# Altium project Gesturelink.PrjPcb (part 2 of 4)

## Sheet LPDDR4.SchDoc
size 420 x 297 mm; SheetNumber: 5; SheetTotal: 16
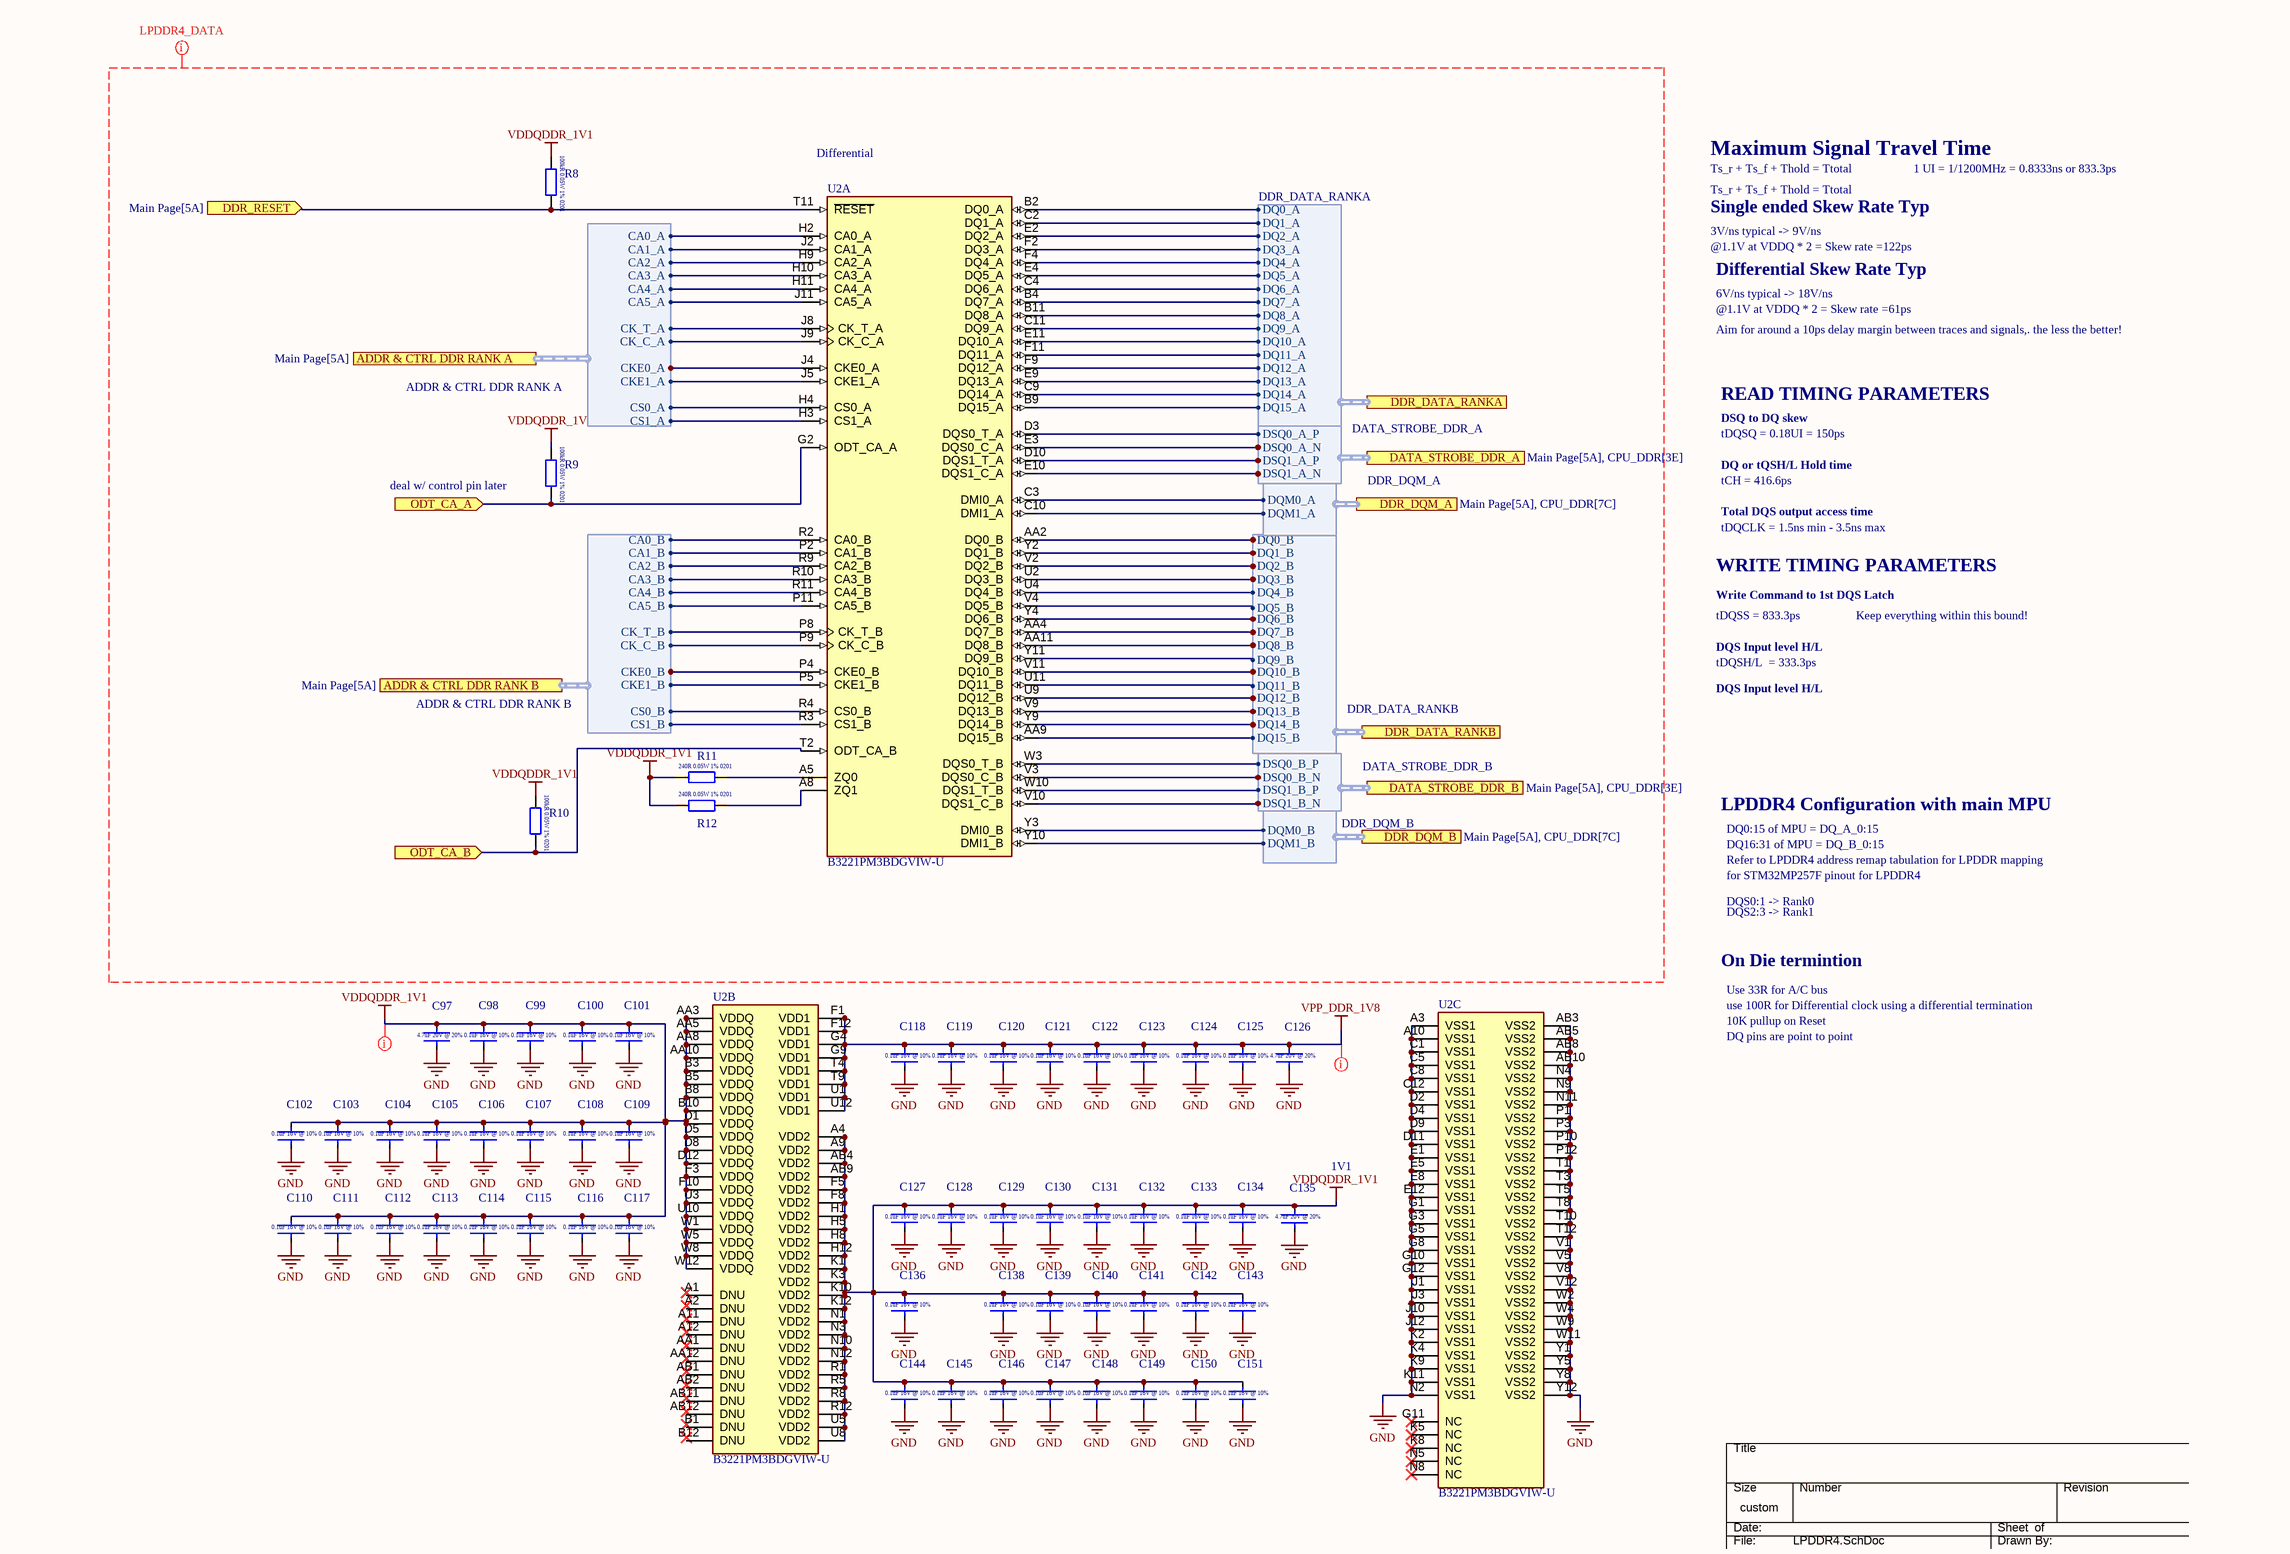
[diagram p5: LPDDR4.SchDoc]

### Parts
C97  4.7uF  [CAPC1005X06L]  (value not drawn)
C98  0.1uF  [CAPC0603X03L]  (value not drawn)
C99  0.1uF  [CAPC0603X03L]  (value not drawn)
C100  0.1uF  [CAPC0603X03L]  (value not drawn)
C101  0.1uF  [CAPC0603X03L]  (value not drawn)
C102  0.1uF  [CAPC0603X03L]  (value not drawn)
C103  0.1uF  [CAPC0603X03L]  (value not drawn)
C104  0.1uF  [CAPC0603X03L]  (value not drawn)
C105  0.1uF  [CAPC0603X03L]  (value not drawn)
C106  0.1uF  [CAPC0603X03L]  (value not drawn)
C107  0.1uF  [CAPC0603X03L]  (value not drawn)
C108  0.1uF  [CAPC0603X03L]  (value not drawn)
C109  0.1uF  [CAPC0603X03L]  (value not drawn)
C110  0.1uF  [CAPC0603X03L]  (value not drawn)
C111  0.1uF  [CAPC0603X03L]  (value not drawn)
C112  0.1uF  [CAPC0603X03L]  (value not drawn)
C113  0.1uF  [CAPC0603X03L]  (value not drawn)
C114  0.1uF  [CAPC0603X03L]  (value not drawn)
C115  0.1uF  [CAPC0603X03L]  (value not drawn)
C116  0.1uF  [CAPC0603X03L]  (value not drawn)
C117  0.1uF  [CAPC0603X03L]  (value not drawn)
C118  0.1uF  [CAPC0603X03L]  (value not drawn)
C119  0.1uF  [CAPC0603X03L]  (value not drawn)
C120  0.1uF  [CAPC0603X03L]  (value not drawn)
C121  0.1uF  [CAPC0603X03L]  (value not drawn)
C122  0.1uF  [CAPC0603X03L]  (value not drawn)
C123  0.1uF  [CAPC0603X03L]  (value not drawn)
C124  0.1uF  [CAPC0603X03L]  (value not drawn)
C125  0.1uF  [CAPC0603X03L]  (value not drawn)
C126  4.7uF  [CAPC1005X06L]  (value not drawn)
C127  0.1uF  [CAPC0603X03L]  (value not drawn)
C128  0.1uF  [CAPC0603X03L]  (value not drawn)
C129  0.1uF  [CAPC0603X03L]  (value not drawn)
C130  0.1uF  [CAPC0603X03L]  (value not drawn)
C131  0.1uF  [CAPC0603X03L]  (value not drawn)
C132  0.1uF  [CAPC0603X03L]  (value not drawn)
C133  0.1uF  [CAPC0603X03L]  (value not drawn)
C134  0.1uF  [CAPC0603X03L]  (value not drawn)
C135  4.7uF  [CAPC1005X06L]  (value not drawn)
C136  0.1uF  [CAPC0603X03L]  (value not drawn)
C138  0.1uF  [CAPC0603X03L]  (value not drawn)
C139  0.1uF  [CAPC0603X03L]  (value not drawn)
C140  0.1uF  [CAPC0603X03L]  (value not drawn)
C141  0.1uF  [CAPC0603X03L]  (value not drawn)
C142  0.1uF  [CAPC0603X03L]  (value not drawn)
C143  0.1uF  [CAPC0603X03L]  (value not drawn)
C144  0.1uF  [CAPC0603X03L]  (value not drawn)
C145  0.1uF  [CAPC0603X03L]  (value not drawn)
C146  0.1uF  [CAPC0603X03L]  (value not drawn)
C147  0.1uF  [CAPC0603X03L]  (value not drawn)
C148  0.1uF  [CAPC0603X03L]  (value not drawn)
C149  0.1uF  [CAPC0603X03L]  (value not drawn)
C150  0.1uF  [CAPC0603X03L]  (value not drawn)
C151  0.1uF  [CAPC0603X03L]  (value not drawn)
R8  ERJ-1GNF1003C  [RESC0603X03L]  (value not drawn)
R9  ERJ-1GNF1003C  [RESC0603X03L]  (value not drawn)
R10  ERJ-1GNF1003C  [RESC0603X03L]  (value not drawn)
R11  ERJ-1GNF2400C  [RESC0603X03L]  (value not drawn)
R12  ERJ-1GNF2400C  [RESC0603X03L]  (value not drawn)
U2  B3221PM3BDGVIW-U  [Q6422PM3BDGVK-U]  (parts A,B,C of 3)

### Ports
ADDR & CTRL DDR RANK A (harness ADDR & CTRL DDR RANK A, see Main Page[5A]), ADDR & CTRL DDR RANK B (harness ADDR & CTRL DDR RANK B, see Main Page[5A]), DATA_STROBE_DDR_A (harness DATA_STROBE_DDR_A, see Main Page[5A], CPU_DDR[3E]), DATA_STROBE_DDR_B (harness DATA_STROBE_DDR_B, see Main Page[5A], CPU_DDR[3E]), DDR_DATA_RANKA (harness DDR_DATA_RANKA, see Main Page[5A], CPU_DDR[3D]), DDR_DATA_RANKB (harness DDR_DATA_RANKB, see Main Page[5A], CPU_DDR[3E]), DDR_DQM_A (harness DDR_DQM_A, see Main Page[5A], CPU_DDR[7C]), DDR_DQM_B (harness DDR_DQM_B, see Main Page[5A], CPU_DDR[7C]), DDR_RESET (in, see Main Page[5A]), ODT_CA_A (in), ODT_CA_B (in)

### Harnesses
DDR_DATA_RANKB: DQ0_B, DQ10_B, DQ11_B, DQ12_B, DQ13_B, DQ14_B, DQ15_B, DQ1_B, DQ2_B, DQ3_B, DQ4_B, DQ5_B, DQ6_B, DQ7_B, DQ8_B, DQ9_B
DDR_DATA_RANKA: DQ0_A, DQ10_A, DQ11_A, DQ12_A, DQ13_A, DQ14_A, DQ15_A, DQ1_A, DQ2_A, DQ3_A, DQ4_A, DQ5_A, DQ6_A, DQ7_A, DQ8_A, DQ9_A
ADDR & CTRL DDR RANK A: CA0_A, CA1_A, CA2_A, CA3_A, CA4_A, CA5_A, CKE0_A, CKE1_A, CK_C_A, CK_T_A, CS0_A, CS1_A
ADDR & CTRL DDR RANK B: CA0_B, CA1_B, CA2_B, CA3_B, CA4_B, CA5_B, CKE0_B, CKE1_B, CK_C_B, CK_T_B, CS0_B, CS1_B
DATA_STROBE_DDR_A: DSQ0_A_N, DSQ0_A_P, DSQ1_A_N, DSQ1_A_P
DATA_STROBE_DDR_B: DSQ0_B_N, DSQ0_B_P, DSQ1_B_N, DSQ1_B_P
DDR_DQM_A: DQM0_A, DQM1_A
DDR_DQM_B: DQM0_B, DQM1_B

### Nets
GND: C97.1 C98.1 C99.1 C100.1 C101.1 C102.1 C103.1 C104.1 C105.1 C106.1 C107.1 C108.1 C109.1 C110.1 C111.1 C112.1 C113.1 C114.1 C115.1 C116.1 C117.1 C118.1 C119.1 C120.1 C121.1 C122.1 C123.1 C124.1 C125.1 C126.1 C127.1 C128.1 C129.1 C130.1 C131.1 C132.1 C133.1 C134.1 C135.1 C136.1 C138.1 C139.1 C140.1 C141.1 C142.1 C143.1 C144.1 C145.1 C146.1 C147.1 C148.1 C149.1 C150.1 C151.1 U2.A3(VSS1) U2.A10(VSS1) U2.AB3(VSS2) U2.AB5(VSS2) U2.AB8(VSS2) U2.AB10(VSS2) U2.C1(VSS1) U2.C5(VSS1) U2.C8(VSS1) U2.C12(VSS1) U2.D2(VSS1) U2.D4(VSS1) U2.D9(VSS1) U2.D11(VSS1) U2.E1(VSS1) U2.E5(VSS1) U2.E8(VSS1) U2.E12(VSS1) U2.G1(VSS1) U2.G3(VSS1) U2.G5(VSS1) U2.G8(VSS1) U2.G10(VSS1) U2.G12(VSS1) U2.J1(VSS1) U2.J3(VSS1) U2.J10(VSS1) U2.J12(VSS1) U2.K2(VSS1) U2.K4(VSS1) U2.K9(VSS1) U2.K11(VSS1) U2.N2(VSS1) U2.N4(VSS2) U2.N9(VSS2) U2.N11(VSS2) U2.P1(VSS2) U2.P3(VSS2) U2.P10(VSS2) U2.P12(VSS2) U2.T1(VSS2) U2.T3(VSS2) U2.T5(VSS2) U2.T8(VSS2) U2.T10(VSS2) U2.T12(VSS2) U2.V1(VSS2) U2.V5(VSS2) U2.V8(VSS2) U2.V12(VSS2) U2.W2(VSS2) U2.W4(VSS2) U2.W9(VSS2) U2.W11(VSS2) U2.Y1(VSS2) U2.Y5(VSS2) U2.Y8(VSS2) U2.Y12(VSS2)
VDDQDDR_1V1: C97.2 C98.2 C99.2 C100.2 C101.2 C102.2 C103.2 C104.2 C105.2 C106.2 C107.2 C108.2 C109.2 C110.2 C111.2 C112.2 C113.2 C114.2 C115.2 C116.2 C117.2 C127.2 C128.2 C129.2 C130.2 C131.2 C132.2 C133.2 C134.2 C135.2 C136.2 C138.2 C139.2 C140.2 C141.2 C142.2 C143.2 C144.2 C145.2 C146.2 C147.2 C148.2 C149.2 C150.2 C151.2 R8.1 R9.1 R10.1 R11.1 R12.1 U2.A4(VDD2) U2.A9(VDD2) U2.AA3(VDDQ) U2.AA5(VDDQ) U2.AA8(VDDQ) U2.AA10(VDDQ) U2.AB4(VDD2) U2.AB9(VDD2) U2.B3(VDDQ) U2.B5(VDDQ) U2.B8(VDDQ) U2.B10(VDDQ) U2.D1(VDDQ) U2.D5(VDDQ) U2.D8(VDDQ) U2.D12(VDDQ) U2.F3(VDDQ) U2.F5(VDD2) U2.F8(VDD2) U2.F10(VDDQ) U2.H1(VDD2) U2.H5(VDD2) U2.H8(VDD2) U2.H12(VDD2) U2.K1(VDD2) U2.K3(VDD2) U2.K10(VDD2) U2.K12(VDD2) U2.N1(VDD2) U2.N3(VDD2) U2.N10(VDD2) U2.N12(VDD2) U2.R1(VDD2) U2.R5(VDD2) U2.R8(VDD2) U2.R12(VDD2) U2.U3(VDDQ) U2.U5(VDD2) U2.U8(VDD2) U2.U10(VDDQ) U2.W1(VDDQ) U2.W5(VDDQ) U2.W8(VDDQ) U2.W12(VDDQ)
VPP_DDR_1V8: C118.2 C119.2 C120.2 C121.2 C122.2 C123.2 C124.2 C125.2 C126.2 U2.F1(VDD1) U2.F12(VDD1) U2.G4(VDD1) U2.G9(VDD1) U2.T4(VDD1) U2.T9(VDD1) U2.U1(VDD1) U2.U12(VDD1)
DDR_CA0_A: U2.H2(CA0_A) ; port ADDR & CTRL DDR RANK A.CA0_A
DDR_CA0_B: U2.R2(CA0_B) ; port ADDR & CTRL DDR RANK B.CA0_B
DDR_CA1_A: U2.J2(CA1_A) ; port ADDR & CTRL DDR RANK A.CA1_A
DDR_CA1_B: U2.P2(CA1_B) ; port ADDR & CTRL DDR RANK B.CA1_B
DDR_CA2_A: U2.H9(CA2_A) ; port ADDR & CTRL DDR RANK A.CA2_A
DDR_CA2_B: U2.R9(CA2_B) ; port ADDR & CTRL DDR RANK B.CA2_B
DDR_CA3_A: U2.H10(CA3_A) ; port ADDR & CTRL DDR RANK A.CA3_A
DDR_CA3_B: U2.R10(CA3_B) ; port ADDR & CTRL DDR RANK B.CA3_B
DDR_CA4_A: U2.H11(CA4_A) ; port ADDR & CTRL DDR RANK A.CA4_A
DDR_CA4_B: U2.R11(CA4_B) ; port ADDR & CTRL DDR RANK B.CA4_B
DDR_CA5_A: U2.J11(CA5_A) ; port ADDR & CTRL DDR RANK A.CA5_A
DDR_CA5_B: U2.P11(CA5_B) ; port ADDR & CTRL DDR RANK B.CA5_B
DDR_CK_A_N: U2.J8(CK_T_A) ; port ADDR & CTRL DDR RANK A.CK_T_A
DDR_CK_A_P: U2.J9(CK_C_A) ; port ADDR & CTRL DDR RANK A.CK_C_A
DDR_CK_B_N: U2.P8(CK_T_B) ; port ADDR & CTRL DDR RANK B.CK_T_B
DDR_CK_B_P: U2.P9(CK_C_B) ; port ADDR & CTRL DDR RANK B.CK_C_B
DDR_CKE0_A: U2.J4(CKE0_A) ; port ADDR & CTRL DDR RANK A.CKE0_A
DDR_CKE0_B: U2.P4(CKE0_B) ; port ADDR & CTRL DDR RANK B.CKE0_B
DDR_CKE1_A: U2.J5(CKE1_A) ; port ADDR & CTRL DDR RANK A.CKE1_A
DDR_CKE1_B: U2.P5(CKE1_B) ; port ADDR & CTRL DDR RANK B.CKE1_B
DDR_CS0_A: U2.H4(CS0_A) ; port ADDR & CTRL DDR RANK A.CS0_A
DDR_CS0_B: U2.R4(CS0_B) ; port ADDR & CTRL DDR RANK B.CS0_B
DDR_CS1_A: U2.H3(CS1_A) ; port ADDR & CTRL DDR RANK A.CS1_A
DDR_CS1_B: U2.R3(CS1_B) ; port ADDR & CTRL DDR RANK B.CS1_B
DDR_DQ0_A: U2.B2(DQ0_A) ; port DDR_DATA_RANKA.DQ0_A
DDR_DQ0_B: U2.AA2(DQ0_B) ; port DDR_DATA_RANKB.DQ0_B
DDR_DQ1_A: U2.C2(DQ1_A) ; port DDR_DATA_RANKA.DQ1_A
DDR_DQ1_B: U2.Y2(DQ1_B) ; port DDR_DATA_RANKB.DQ1_B
DDR_DQ2_A: U2.E2(DQ2_A) ; port DDR_DATA_RANKA.DQ2_A
DDR_DQ2_B: U2.V2(DQ2_B) ; port DDR_DATA_RANKB.DQ2_B
DDR_DQ3_A: U2.F2(DQ3_A) ; port DDR_DATA_RANKA.DQ3_A
DDR_DQ3_B: U2.U2(DQ3_B) ; port DDR_DATA_RANKB.DQ3_B
DDR_DQ4_A: U2.F4(DQ4_A) ; port DDR_DATA_RANKA.DQ4_A
DDR_DQ4_B: U2.U4(DQ4_B) ; port DDR_DATA_RANKB.DQ4_B
DDR_DQ5_A: U2.E4(DQ5_A) ; port DDR_DATA_RANKA.DQ5_A
DDR_DQ5_B: U2.V4(DQ5_B) ; port DDR_DATA_RANKB.DQ5_B
DDR_DQ6_A: U2.C4(DQ6_A) ; port DDR_DATA_RANKA.DQ6_A
DDR_DQ6_B: U2.Y4(DQ6_B) ; port DDR_DATA_RANKB.DQ6_B
DDR_DQ7_A: U2.B4(DQ7_A) ; port DDR_DATA_RANKA.DQ7_A
DDR_DQ7_B: U2.AA4(DQ7_B) ; port DDR_DATA_RANKB.DQ7_B
DDR_DQ8_A: U2.B11(DQ8_A) ; port DDR_DATA_RANKA.DQ8_A
DDR_DQ8_B: U2.AA11(DQ8_B) ; port DDR_DATA_RANKB.DQ8_B
DDR_DQ9_A: U2.C11(DQ9_A) ; port DDR_DATA_RANKA.DQ9_A
DDR_DQ9_B: U2.Y11(DQ9_B) ; port DDR_DATA_RANKB.DQ9_B
DDR_DQ10_A: U2.E11(DQ10_A) ; port DDR_DATA_RANKA.DQ10_A
DDR_DQ10_B: U2.V11(DQ10_B) ; port DDR_DATA_RANKB.DQ10_B
DDR_DQ11_A: U2.F11(DQ11_A) ; port DDR_DATA_RANKA.DQ11_A
DDR_DQ11_B: U2.U11(DQ11_B) ; port DDR_DATA_RANKB.DQ11_B
DDR_DQ12_A: U2.F9(DQ12_A) ; port DDR_DATA_RANKA.DQ12_A
DDR_DQ12_B: U2.U9(DQ12_B) ; port DDR_DATA_RANKB.DQ12_B
DDR_DQ13_A: U2.E9(DQ13_A) ; port DDR_DATA_RANKA.DQ13_A
DDR_DQ13_B: U2.V9(DQ13_B) ; port DDR_DATA_RANKB.DQ13_B
DDR_DQ14_A: U2.C9(DQ14_A) ; port DDR_DATA_RANKA.DQ14_A
DDR_DQ14_B: U2.Y9(DQ14_B) ; port DDR_DATA_RANKB.DQ14_B
DDR_DQ15_A: U2.B9(DQ15_A) ; port DDR_DATA_RANKA.DQ15_A
DDR_DQ15_B: U2.AA9(DQ15_B) ; port DDR_DATA_RANKB.DQ15_B
DDR_DQM0_A: U2.C3(DMI0_A) ; port DDR_DQM_A.DQM0_A
DDR_DQM0_B: U2.Y3(DMI0_B) ; port DDR_DQM_B.DQM0_B
DDR_DQM1_A: U2.C10(DMI1_A) ; port DDR_DQM_A.DQM1_A
DDR_DQM1_B: U2.Y10(DMI1_B) ; port DDR_DQM_B.DQM1_B
DDR_RESET: R8.2 U2.T11(~{RESET}) ; port DDR_RESET
DSQ0_A_N: U2.E3(DQS0_C_A) ; port DATA_STROBE_DDR_A.DSQ0_A_N
DSQ0_A_P: U2.D3(DQS0_T_A) ; port DATA_STROBE_DDR_A.DSQ0_A_P
DSQ0_B_N: U2.V3(DQS0_C_B) ; port DATA_STROBE_DDR_B.DSQ0_B_N
DSQ0_B_P: U2.W3(DQS0_T_B) ; port DATA_STROBE_DDR_B.DSQ0_B_P
DSQ1_A_N: U2.E10(DQS1_C_A) ; port DATA_STROBE_DDR_A.DSQ1_A_N
DSQ1_A_P: U2.D10(DQS1_T_A) ; port DATA_STROBE_DDR_A.DSQ1_A_P
DSQ1_B_N: U2.V10(DQS1_C_B) ; port DATA_STROBE_DDR_B.DSQ1_B_N
DSQ1_B_P: U2.W10(DQS1_T_B) ; port DATA_STROBE_DDR_B.DSQ1_B_P
NetR9_2: R9.2 U2.G2(ODT_CA_A) ; port ODT_CA_A
NetR10_2: R10.2 U2.T2(ODT_CA_B) ; port ODT_CA_B
NetR11_2: R11.2 U2.A5(ZQ0)
NetR12_2: R12.2 U2.A8(ZQ1)

Not connected (* = marked no-connect by the designer): U2 A1(DNU) A2(DNU) A11(DNU) A12(DNU) AA1(DNU) AA12(DNU) AB1(DNU) AB2(DNU) AB11(DNU) AB12(DNU) B1(DNU) B12(DNU) G11(NC)* K5(NC)* K8(NC)* N5(NC)* N8(NC)*

### Layout directives
net class LPDDR4_DATA: VDDQDDR_1V1
net class LPDDR4_PWR: VDDQDDR_1V1, VPP_DDR_1V8

### Notes on the sheet
- (near U2) Differential
- Maximum Signal Travel Time
- Ts_r + Ts_f + Thold = Ttotal
- 1 UI = 1/1200MHz = 0.8333ns or 833.3ps
- Single ended Skew Rate Typ
- 3V/ns typical -> 9V/ns
- @1.1V at VDDQ * 2 = Skew rate =122ps
- Differential Skew Rate Typ
- 6V/ns typical -> 18V/ns
- @1.1V at VDDQ * 2 = Skew rate =61ps
- Aim for around a 10ps delay margin between traces and signals,. the less the better!
- tDQSQ = 0.18UI = 150ps
- DSQ to DQ skew
- READ TIMING PARAMETERS
- (near R9) deal w/ control pin later
- DQ or tQSH/L Hold time
- tCH = 416.6ps
- Total DQS output access time
- WRITE TIMING PARAMETERS
- tDQCLK = 1.5ns min - 3.5ns max
- Write Command to 1st DQS Latch
- tDQSS = 833.3ps
- DQS Input level H/L
- Keep everything within this bound!
- tDQSH/L  = 333.3ps
- LPDDR4 Configuration with main MPU
- DQ0:15 of MPU = DQ_A_0:15
- DQ16:31 of MPU = DQ_B_0:15
- Refer to LPDDR4 address remap tabulation for LPDDR mapping
- for STM32MP257F pinout for LPDDR4
- DQS0:1 -> Rank0
- DQS2:3 -> Rank1
- On Die termintion
- Use 33R for A/C bus
- use 100R for Differential clock using a differential termination
- 10K pullup on Reset
- DQ pins are point to point
- 1V1
- THIS DOCUMENT AND THE DATA DISCLOSED HEREIN OR
- HEREWITH IS THE PROPERTY OF ALTIUM LIMITED AND MAY
- DWG NO:
- REVISION
- REV:
- DESCRIPTION
- DATE
- APPROVED
- BE FREELY DISTRIBUTED IN WHOLE. NO RIGHTS ARE
- RESERVED OR EXPRESS OR IMPLIED WARANTEE GIVEN.
- ENG:
- APPROVALS
- PROJECT
- DSN:
- CHK:
- REFERENCE DOCUMENTS
- PROJECT REVISION:
- TITLE
- DOCUMENT REVISION:
- DESIGN ITEM:
- BOM:
- FAB DWG:
- PCB DWG:
- ASSY DWG:
- SCALE:
- A3
- SIZE
- CAGE CODE
- FILE NAME
- DWG NO.
- SHEET
- OF
- REV
- (in symbol CL05A475MO5NUNC) 4.7uF 20V @ 20%
- (in symbol ERJ-1GNF1003C) 100kR 0.05W 1% 0201
- (in symbol ERJ-1GNF2400C) 240R 0.05W 1% 0201
- (in symbol GRM033R61E104KE14J) 0.1uF 16V @ 10%

### Library data of the parts
C97 C126 C135 = CL05A475MO5NUNC: 4.7 µF ±20% 16V Ceramic Capacitor X5R 0402 (1005 Metric)
C98-C125 C127-C134 C136 C138-C151 = GRM033R61E104KE14J: 0.1 µF ±10% 25V Ceramic Capacitor X5R 0201 (0603 Metric)0.1 µF ±10% 25V Ceramic Capacitor X5R 0201 (0603 Metric)
R8-R10 = ERJ-1GNF1003C: 100 kOhms ±1% 0.05W, 1/20W Chip Resistor 0201 (0603 Metric) Thick Film; ComponentLink1Description: New link; ComponentLink1URL: https://www.digikey.com.au/en/products/detail/panasonic-electronic-components/ERJ-1GNF1003C/2036340
U2 = Q6422PM3BDGVK-U: SDRAM - Mobile LPDDR4 Memory IC 64Gbit 2.133 GHz 3.5 ns 200-FBGA (10x14.5); Package: None; Price: None; Value: *; MP: Q6422PM3BDGVK-U; Availability: Unavailable; ComponentLink1Description: New link; ComponentLink1URL: https://www.digikey.com.au/en/products/detail/kingston-technology/Q6422PM3BDGVK-U/25321958?gad_source=1&gbraid=0AAAAADrbLlj2-DufyOLmPBQqugpZCYbaj&gclid=Cj0KCQjwzrzABhD8ARIsANlSWNPtBMk-xmUbnWeTZrE8FXO4iVJvRiPTf1MXYD-jc0_9yWwB78P3EFEaAgkvEALw_wcB&gclsrc=aw.ds
R11 R12 = ERJ-1GNF2400C: ComponentLink1Description: New link; ComponentLink1URL: https://www.digikey.com.au/en/products/detail/panasonic-electronic-components/ERJ-1GNF2400C/2036039

## Sheet Power Management.SchDoc
size 594 x 420 mm; SheetNumber: 6; SheetTotal: 16; SPICEModelCacheIIFAMJZA: <root> / <DocumentId>IIFAMJZA</DocumentId> / </root>
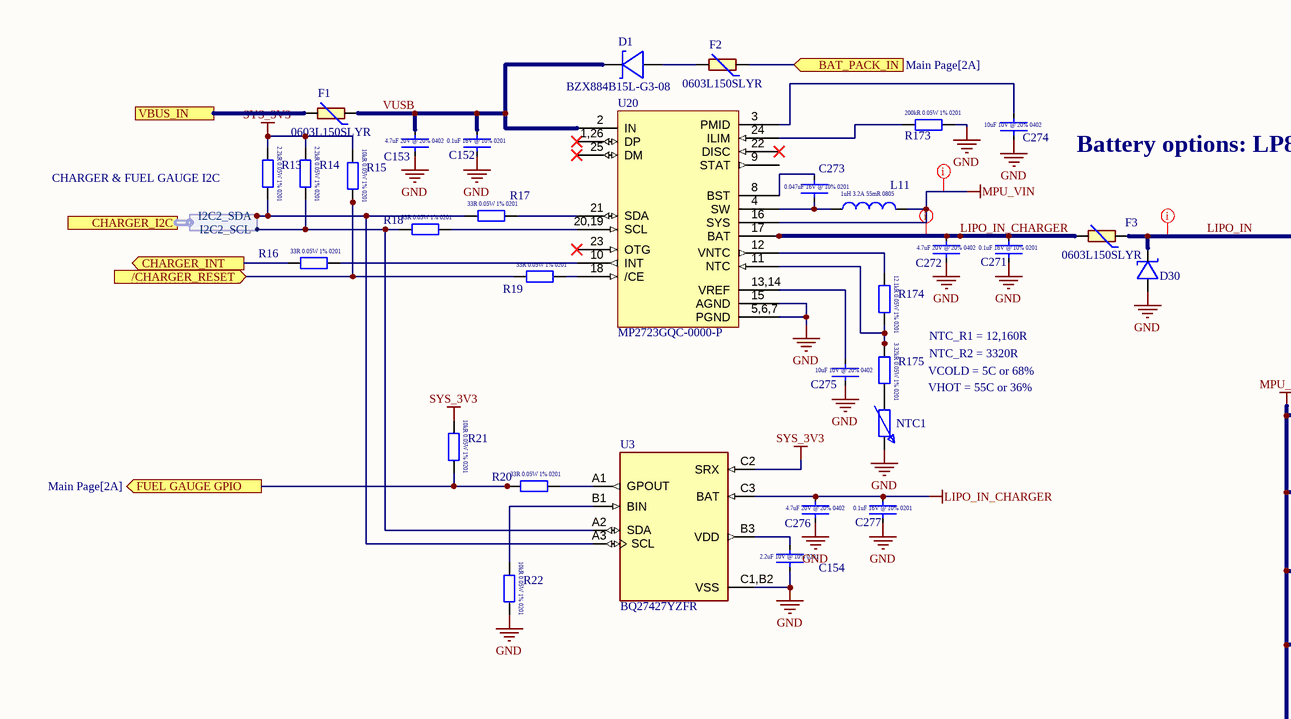
[diagram p6: Power Management.SchDoc, top left]
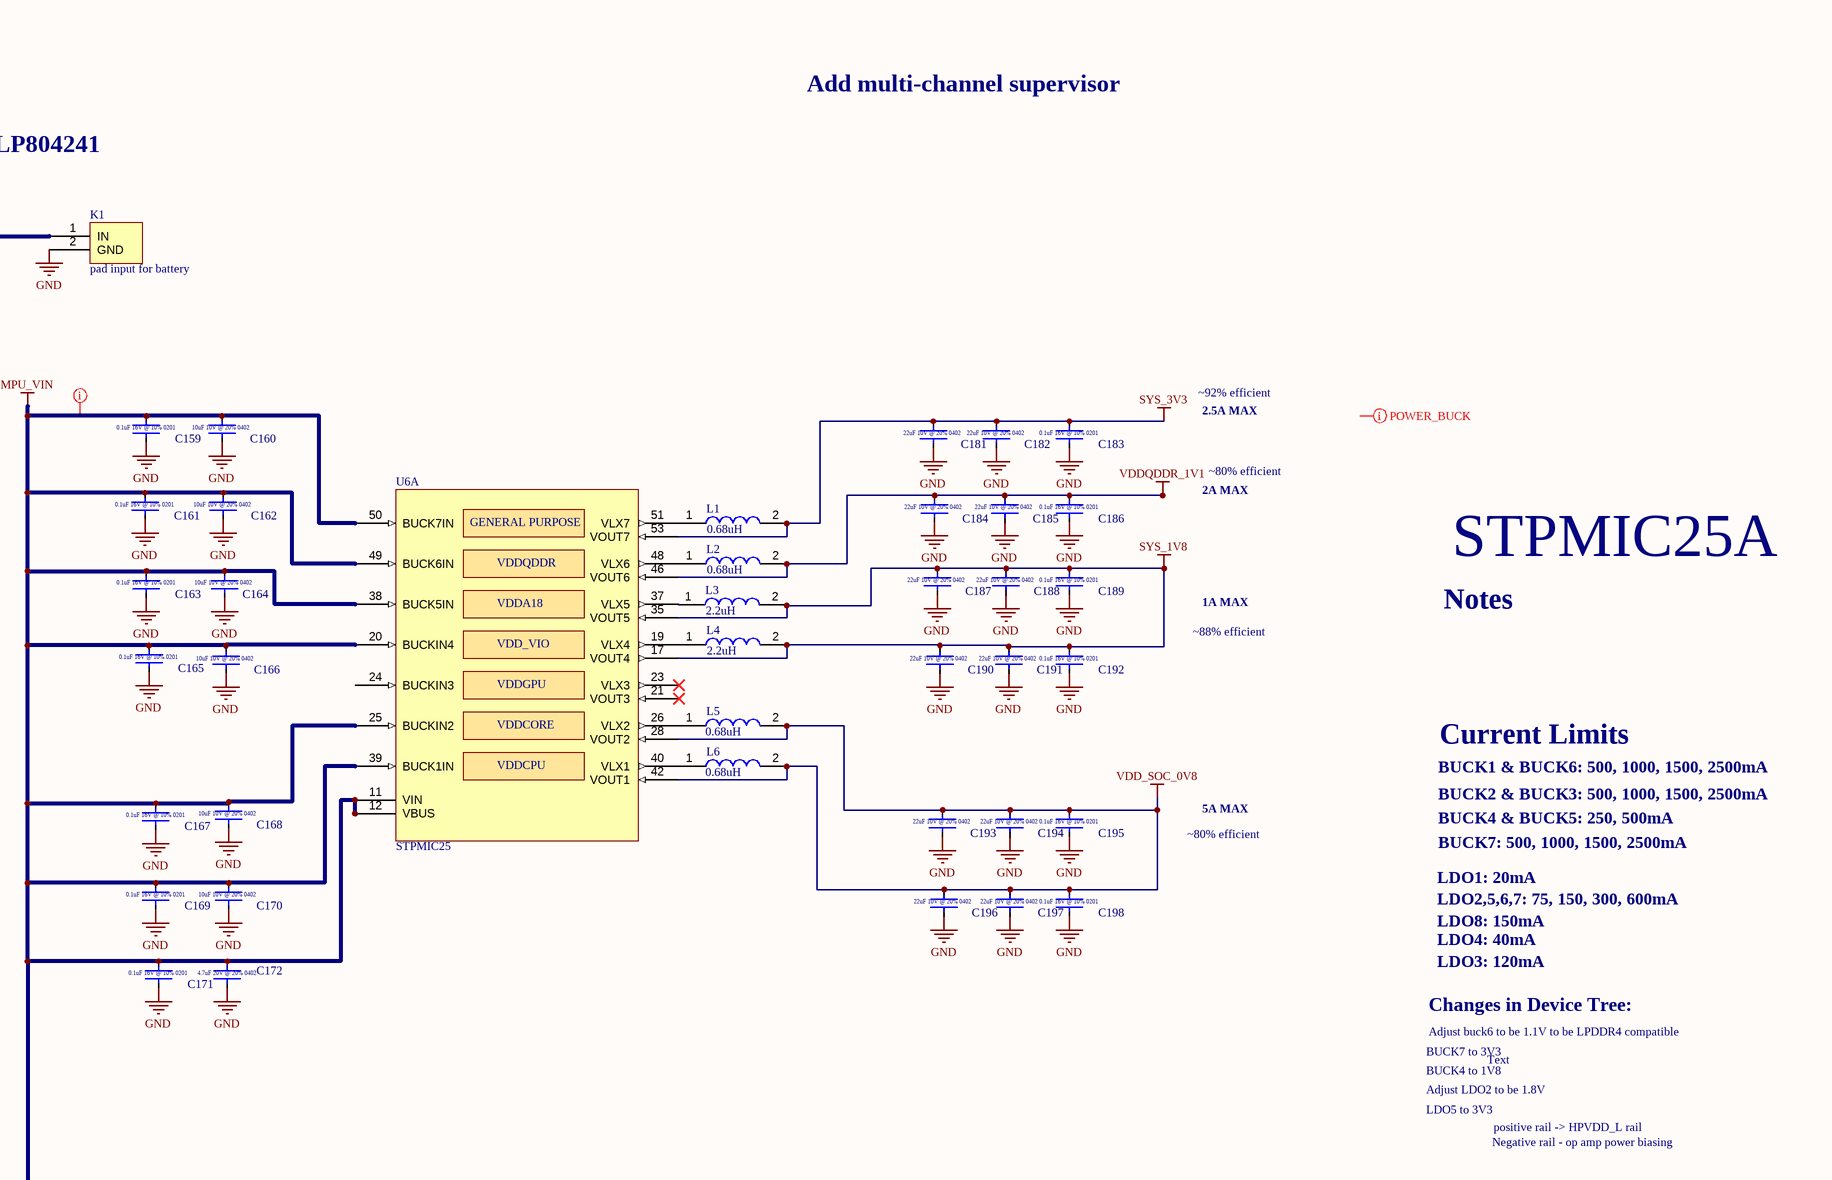
[diagram p7: Power Management.SchDoc, top right]
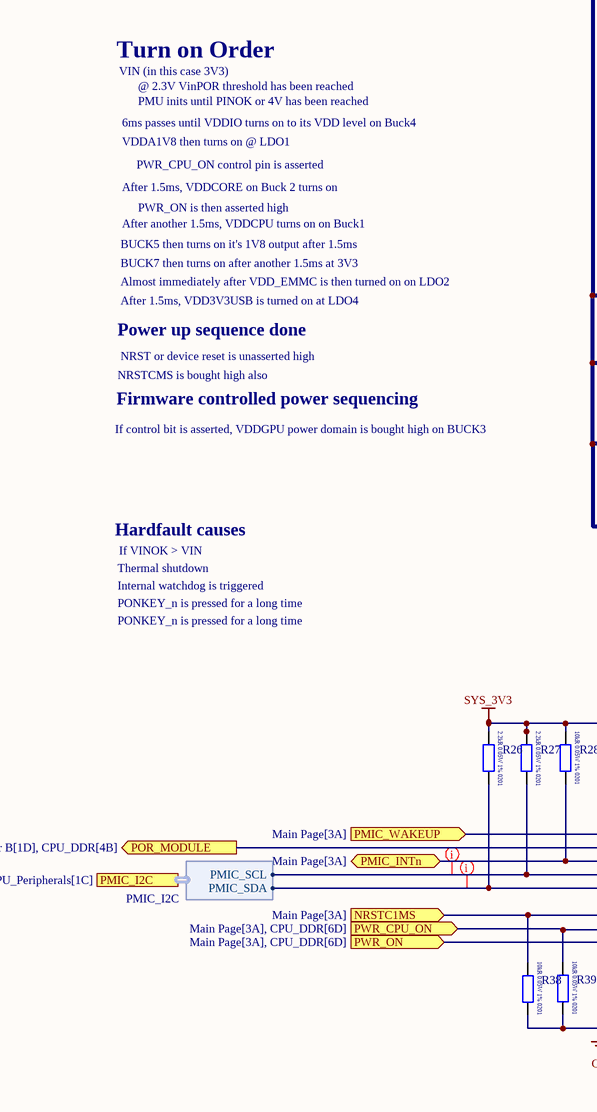
[diagram p8: Power Management.SchDoc, bottom left]
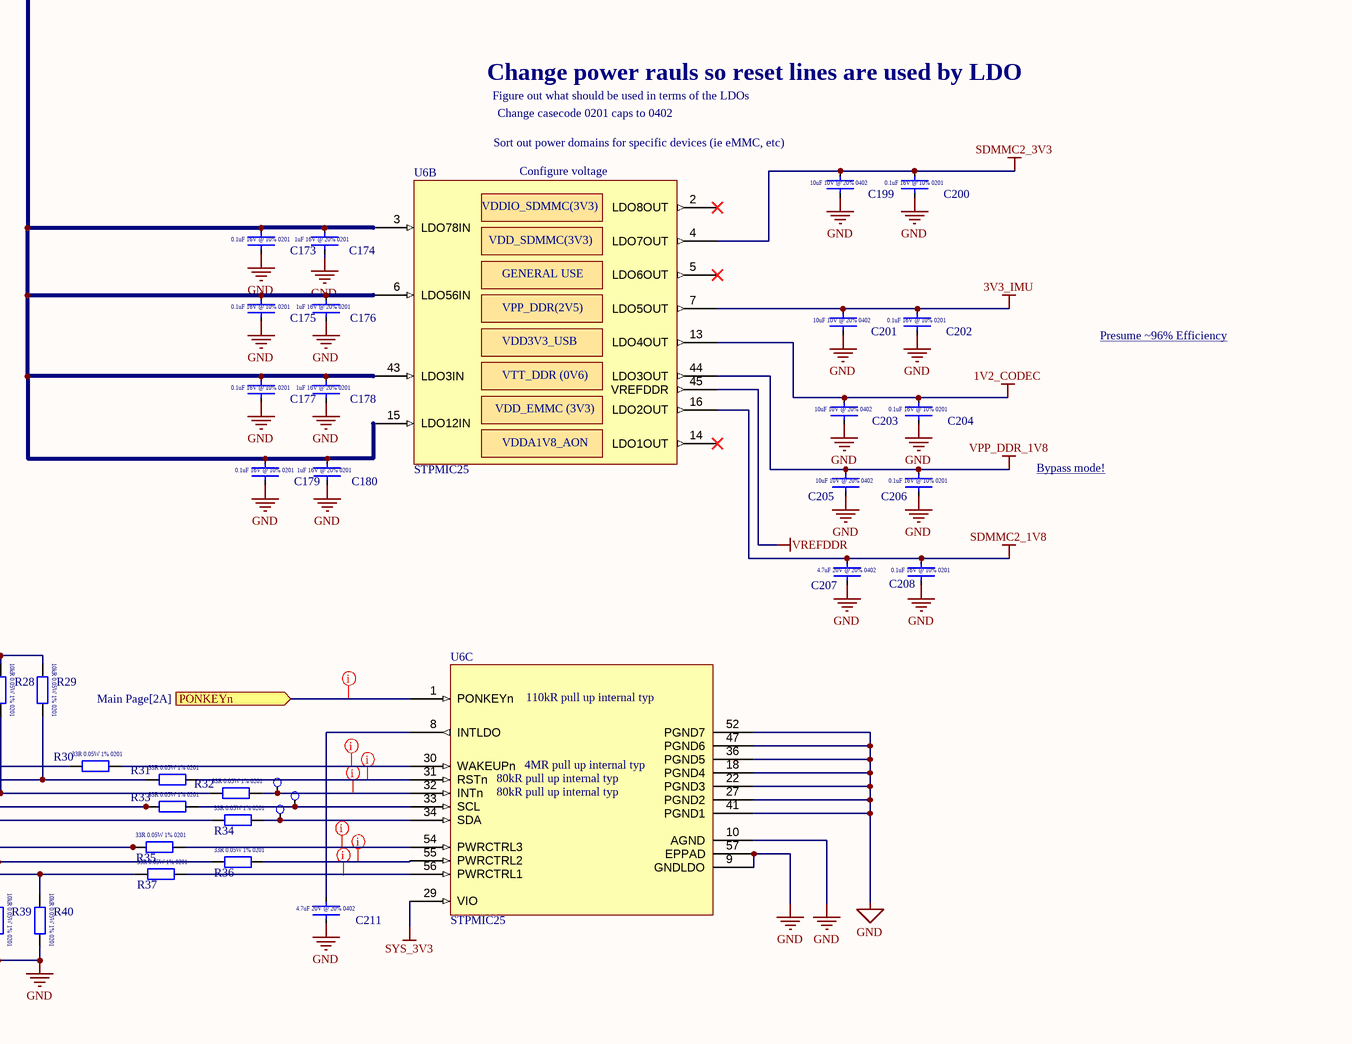
[diagram p9: Power Management.SchDoc, bottom right]

### Parts
(Parts that share a designator on the sheet are numbered #1, #2 ... from top to bottom, then left to right.)
C152  0.1uF  [CAPC0603X03L]  (value not drawn)
C153  4.7uF  [CAPC1005X06L]  (value not drawn)
C154  GRM033R61A225KE47D  [CAPC0603X03L]  (value not drawn)
C159  0.1uF  [CAPC0603X03L]  (value not drawn)
C160  GRT155R61A106ME13J  [CAPC1005X06L]  (value not drawn)
C161  0.1uF  [CAPC0603X03L]  (value not drawn)
C162  GRT155R61A106ME13J  [CAPC1005X06L]  (value not drawn)
C163  0.1uF  [CAPC0603X03L]  (value not drawn)
C164  GRT155R61A106ME13J  [CAPC1005X06L]  (value not drawn)
C165  0.1uF  [CAPC0603X03L]  (value not drawn)
C166  GRT155R61A106ME13J  [CAPC1005X06L]  (value not drawn)
C167  0.1uF  [CAPC0603X03L]  (value not drawn)
C168  GRT155R61A106ME13J  [CAPC1005X06L]  (value not drawn)
C169  0.1uF  [CAPC0603X03L]  (value not drawn)
C170  GRT155R61A106ME13J  [CAPC1005X06L]  (value not drawn)
C171  0.1uF  [CAPC0603X03L]  (value not drawn)
C172  4.7uF  [CAPC1005X06L]  (value not drawn)
C173  0.1uF  [CAPC0603X03L]  (value not drawn)
C174  GRM033R61C105ME15D  [CAPC0603X03L]  (value not drawn)
C175  0.1uF  [CAPC0603X03L]  (value not drawn)
C176  GRM033R61C105ME15D  [CAPC0603X03L]  (value not drawn)
C177  0.1uF  [CAPC0603X03L]  (value not drawn)
C178  GRM033R61C105ME15D  [CAPC0603X03L]  (value not drawn)
C179  0.1uF  [CAPC0603X03L]  (value not drawn)
C180  GRM033R61C105ME15D  [CAPC0603X03L]  (value not drawn)
C181  GRM158R61A226ME15D  [CAPC1005X06L]  (value not drawn)
C182  GRM158R61A226ME15D  [CAPC1005X06L]  (value not drawn)
C183  0.1uF  [CAPC0603X03L]  (value not drawn)
C184  GRM158R61A226ME15D  [CAPC1005X06L]  (value not drawn)
C185  GRM158R61A226ME15D  [CAPC1005X06L]  (value not drawn)
C186  0.1uF  [CAPC0603X03L]  (value not drawn)
C187  GRM158R61A226ME15D  [CAPC1005X06L]  (value not drawn)
C188  GRM158R61A226ME15D  [CAPC1005X06L]  (value not drawn)
C189  0.1uF  [CAPC0603X03L]  (value not drawn)
C190  GRM158R61A226ME15D  [CAPC1005X06L]  (value not drawn)
C191  GRM158R61A226ME15D  [CAPC1005X06L]  (value not drawn)
C192  0.1uF  [CAPC0603X03L]  (value not drawn)
C193  GRM158R61A226ME15D  [CAPC1005X06L]  (value not drawn)
C194  GRM158R61A226ME15D  [CAPC1005X06L]  (value not drawn)
C195  0.1uF  [CAPC0603X03L]  (value not drawn)
C196  GRM158R61A226ME15D  [CAPC1005X06L]  (value not drawn)
C197  GRM158R61A226ME15D  [CAPC1005X06L]  (value not drawn)
C198  0.1uF  [CAPC0603X03L]  (value not drawn)
C199  GRT155R61A106ME13J  [CAPC1005X06L]  (value not drawn)
C200  0.1uF  [CAPC0603X03L]  (value not drawn)
C201  GRT155R61A106ME13J  [CAPC1005X06L]  (value not drawn)
C202  0.1uF  [CAPC0603X03L]  (value not drawn)
C203  GRT155R61A106ME13J  [CAPC1005X06L]  (value not drawn)
C204  0.1uF  [CAPC0603X03L]  (value not drawn)
C205  GRT155R61A106ME13J  [CAPC1005X06L]  (value not drawn)
C206  0.1uF  [CAPC0603X03L]  (value not drawn)
C207  4.7uF  [CAPC1005X06L]  (value not drawn)
C208  0.1uF  [CAPC0603X03L]  (value not drawn)
C211  4.7uF  [CAPC1005X06L]  (value not drawn)
C271  0.1uF  [CAPC0603X03L]  (value not drawn)
C272  4.7uF  [CAPC1005X06L]  (value not drawn)
C273  GRT033R61C473KE01J  [CAPC0603X03L]  (value not drawn)
C274  GRM155R61A106ME11D  [CAPC1005X06L]  (value not drawn)
C275  GRM155R61A106ME11D  [CAPC1005X06L]  (value not drawn)
C276  4.7uF  [CAPC1005X06L]  (value not drawn)
C277  0.1uF  [CAPC0603X03L]  (value not drawn)
D1  BZX884B15L-G3-08  [BZX884B15L-G3-08]
D30  RCLAMP04041PW.C  [RCLAMP04041PW.C]  (value not drawn)
F1  0603L150SLYR  [FUSC1608X100N]
F2  0603L150SLYR  [FUSC1608X100N]
F3  0603L150SLYR  [FUSC1608X100N]
K1  pad input for battery  [pad power input]
L1  0.68uH  [1285ASH1R0MP2]
L2  0.68uH  [1285ASH1R0MP2]
L3  2.2uH  [1285ASH1R0MP2]
L4  2.2uH  [1285ASH1R0MP2]
L5  0.68uH  [1285ASH1R0MP2]
L6  0.68uH  [1285ASH1R0MP2]
L11  IHHP0805ZHER1R0M01  [IHHP0805ZHER1R0M01 - duplicate]  (value not drawn)
NTC1  B57540G1103F000  [B57540G1103F000]  (value not drawn)
R13  RC0201FR-072K2L  [RESC0603X03L]  (value not drawn)
R14  RC0201FR-072K2L  [RESC0603X03L]  (value not drawn)
R15  ERJ-1GNF1002C  [RESC0603X03L]  (value not drawn)
R16  ERJ-1GNF33R0C  [RESC0603X03L]  (value not drawn)
R17  ERJ-1GNF33R0C  [RESC0603X03L]  (value not drawn)
R18  ERJ-1GNF33R0C  [RESC0603X03L]  (value not drawn)
R19  ERJ-1GNF33R0C  [RESC0603X03L]  (value not drawn)
R20  ERJ-1GNF33R0C  [RESC0603X03L]  (value not drawn)
R21  ERJ-1GNF1002C  [RESC0603X03L]  (value not drawn)
R22  ERJ-1GNF1002C  [RESC0603X03L]  (value not drawn)
R26  RC0201FR-072K2L  [RESC0603X03L]  (value not drawn)
R27  RC0201FR-072K2L  [RESC0603X03L]  (value not drawn)
R28  ERJ-1GNF1002C  [RESC0603X03L]  (value not drawn)
R29  ERJ-1GNF1002C  [RESC0603X03L]  (value not drawn)
R30  ERJ-1GNF33R0C  [RESC0603X03L]  (value not drawn)
R31  ERJ-1GNF33R0C  [RESC0603X03L]  (value not drawn)
R32  ERJ-1GNF33R0C  [RESC0603X03L]  (value not drawn)
R33  ERJ-1GNF33R0C  [RESC0603X03L]  (value not drawn)
R34  ERJ-1GNF33R0C  [RESC0603X03L]  (value not drawn)
R35  ERJ-1GNF33R0C  [RESC0603X03L]  (value not drawn)
R36  ERJ-1GNF33R0C  [RESC0603X03L]  (value not drawn)
R37  ERJ-1GNF33R0C  [RESC0603X03L]  (value not drawn)
R38  ERJ-1GNF1002C  [RESC0603X03L]  (value not drawn)
R39  ERJ-1GNF1002C  [RESC0603X03L]  (value not drawn)
R40  ERJ-1GNF1002C  [RESC0603X03L]  (value not drawn)
R173  RC0201FR-07200KL  [RESC0603X03L]  (value not drawn)
R174  RK73H1HTTC1212F  [RESC0603X03L]  (value not drawn)
R175  ERJ-1GNF3321C  [RESC0603X03L]  (value not drawn)
TP30  Test Point  [Test Point]  (value not drawn)
TP31  Test Point  [Test Point]  (value not drawn)
TP32  Test Point  [Test Point]  (value not drawn)
U3#1  BQ27427YZFR  [BQ27427YZFR]
U6  STPMIC25  [QFN127P600-8N]  (parts A,B,C of 3)
U20  MP2723GQC-0000-P  [MP2723GQC-0000-P]

### Ports
/CHARGER_RESET (in, see Main Page[3A]), BAT_PACK_IN (in, see Main Page[2A]), CHARGER_I2C (harness CHARGER & FUEL GAUGE I2C, see Main Page[3A]), CHARGER_INT (out, see Main Page[3A]), FUEL GAUGE GPIO (out, see Main Page[2A]), NRSTC1MS (in, see Main Page[3A]), PMIC_I2C (harness PMIC_I2C, see Main Page[3A], CPU_Peripherals[1C]), PMIC_INTn (bidir, see Main Page[3A]), PMIC_WAKEUP (in, see Main Page[3A]), PONKEYn (in, see Main Page[2A]), POR_MODULE (out, see Main Page[3A], Connector B[1D], CPU_DDR[4B]), PWR_CPU_ON (in, see Main Page[3A], CPU_DDR[6D]), PWR_ON (in, see Main Page[3A], CPU_DDR[6D]), VBUS_IN (see Main Page[2A])

### Harnesses
PMIC_I2C: PMIC_SCL, PMIC_SDA
CHARGER & FUEL GAUGE I2C: I2C2_SCL, I2C2_SDA

### Nets
1V2_CODEC: C203.2 C204.2 U6.13(LDO4OUT)
3V3_IMU: C201.2 C202.2 U6.7(LDO5OUT)
BAT_PACK_IN: F2.1 ; port BAT_PACK_IN
GND: C152.1 C153.1 C154.1 C159.1 C160.1 C161.1 C162.1 C163.1 C164.1 C165.1 C166.1 C167.1 C168.1 C169.1 C170.1 C171.1 C172.1 C173.1 C174.1 C175.1 C176.1 C177.1 C178.1 C179.1 C180.1 C181.1 C182.1 C183.1 C184.1 C185.1 C186.1 C187.1 C188.1 C189.1 C190.1 C191.1 C192.1 C193.1 C194.1 C195.1 C196.1 C197.1 C198.1 C199.1 C200.1 C201.1 C202.1 C203.1 C204.1 C205.1 C206.1 C207.1 C208.1 C211.1 C271.1 C272.1 C274.1 C275.1 C276.1 C277.1 D30.1 K1.2(GND) NTC1.2 R22.2 R38.2 R39.2 R40.2 R173.2 U3#1.C1,B2(VSS) U6.9(GNDLDO) U6.10(AGND) U6.18(PGND4) U6.22(PGND3) U6.27(PGND2) U6.36(PGND5) U6.41(PGND1) U6.47(PGND6) U6.52(PGND7) U6.57(EPPAD) U20.5,6,7(PGND) U20.15(AGND)
I2C2_SCL: R14.2 R18.1 U3#1.A2(SDA) ; port CHARGER_I2C.I2C2_SCL
I2C2_SDA: R13.2 R17.1 U3#1.A3(SCL) ; port CHARGER_I2C.I2C2_SDA
I2C7_SCL: R27.2 R33.1 ; port PMIC_I2C.PMIC_SCL
I2C7_SDA: R26.2 R34.1 ; port PMIC_I2C.PMIC_SDA
LIPO_IN_CHARGER: C271.2 C272.2 C276.2 C277.2 F3.2 U3#1.C3(BAT) U20.17(BAT)
MPU_VIN: C159.2 C160.2 C161.2 C162.2 C163.2 C164.2 C165.2 C166.2 C167.2 C168.2 C169.2 C170.2 C171.2 C172.2 C173.2 C174.2 C175.2 C176.2 C177.2 C178.2 C179.2 C180.2 L11.2 U6.3(LDO78IN) U6.6(LDO56IN) U6.11(VIN) U6.12(VBUS) U6.15(LDO12IN) U6.20(BUCKIN4) U6.25(BUCKIN2) U6.38(BUCK5IN) U6.39(BUCK1IN) U6.43(LDO3IN) U6.49(BUCK6IN) U6.50(BUCK7IN) U20.16(SYS)
SDMMC2_1V8: C207.2 C208.2 U6.16(LDO2OUT)
SDMMC2_3V3: C199.2 C200.2 U6.4(LDO7OUT)
SYS_1V8: C187.2 C188.2 C189.2 C190.2 C191.2 C192.2 L3.2 L4.2 U6.17(VOUT4) U6.35(VOUT5)
SYS_3V3: C181.2 C182.2 C183.2 L1.2 R13.1 R14.1 R15.1 R21.1 R26.1 R27.1 R28.1 R29.1 U3#1.C2(SRX) U6.29(VIO) U6.53(VOUT7)
USB_VIN: F1.2 ; port VBUS_IN
VDD_SOC_0V8: C193.2 C194.2 C195.2 C196.2 C197.2 C198.2 L5.2 L6.2 U6.28(VOUT2) U6.42(VOUT1)
VDDQDDR_1V1: C184.2 C185.2 C186.2 L2.2 U6.46(VOUT6)
VPP_DDR_1V8: C205.2 C206.2 U6.44(LDO3OUT)
VREFDDR: U6.45(VREFDDR)
/NRST: R29.2 R31.1 ; port POR_MODULE
/NRSTC1MS: R35.1 R38.1 ; port NRSTC1MS
INTn_PMIC: R28.2 R32.1 ; port PMIC_INTn
LIPO_IN: D30.2 F3.1 K1.1(IN)
VUSB: C152.2 C153.2 D1.2(out) F1.1 U20.2(IN)
WAKEUPn_PMIC: R30.1 ; port PMIC_WAKEUP
NetC154_2: C154.2 U3#1.B3(VDD)
NetC211_2: C211.2 U6.8(INTLDO)
NetC273_1: C273.1 L11.1 U20.4(SW)
NetC273_2: C273.2 U20.8(BST)
NetC274_2: C274.2 U20.3(PMID)
NetC275_2: C275.2 U20.13,14(VREF)
NetD1_1: D1.1(in) F2.2
NetL1_1: L1.1 U6.51(VLX7)
NetL2_1: L2.1 U6.48(VLX6)
NetL3_1: L3.1 U6.37(VLX5)
NetL4_1: L4.1 U6.19(VLX4)
NetL5_1: L5.1 U6.26(VLX2)
NetL6_1: L6.1 U6.40(VLX1)
NetNTC1_1: NTC1.1 R175.2
NetR15_2: R15.2 R19.1 ; port /CHARGER_RESET
NetR16_1: R16.1 ; port CHARGER_INT
NetR16_2: R16.2 U20.10(INT)
NetR17_2: R17.2 U20.21(SDA)
NetR18_2: R18.2 U20.20,19(SCL)
NetR19_2: R19.2 U20.18(/CE)
NetR20_1: R20.1 R21.2 ; port FUEL GAUGE GPIO
NetR20_2: R20.2 U3#1.A1(GPOUT)
NetR22_1: R22.1 U3#1.B1(BIN)
NetR30_2: R30.2 U6.30(WAKEUPn)
NetR31_2: R31.2 U6.31(RSTn)
NetR32_2: R32.2 TP30.12 U6.32(INTn)
NetR33_2: R33.2 TP31.12 U6.33(SCL)
NetR34_2: R34.2 TP32.12 U6.34(SDA)
NetR35_2: R35.2 U6.54(PWRCTRL3)
NetR36_1: R36.1 R39.1 ; port PWR_CPU_ON
NetR36_2: R36.2 U6.55(PWRCTRL2)
NetR37_1: R37.1 R40.1 ; port PWR_ON
NetR37_2: R37.2 U6.56(PWRCTRL1)
NetR173_1: R173.1 U20.24(ILIM)
NetR174_1: R174.1 U20.12(VNTC)
NetR174_2: R174.2 R175.1 U20.11(NTC)
NetU6_1: U6.1(PONKEYn) ; port PONKEYn

Not connected (* = marked no-connect by the designer): U6 2(LDO8OUT)* 5(LDO6OUT)* 14(LDO1OUT)* 21(VOUT3)* 23(VLX3)* 24(BUCKIN3); U20 1,26(DP)* 9(STAT) 22(DISC)* 23(OTG)* 25(DM)*

### Layout directives
net class Power Buck: (no net found under the mark)
net class I2C_PWR: I2C7_SCL, I2C7_SDA
net class PMIC_CTRL: (no net found under the mark), NetR30_2, NetR31_2, NetR32_2, NetR36_2, NetU6_1
net class BAT_PACK_CHARGE_IN: LIPO_IN, LIPO_IN_CHARGER, MPU_VIN
net class PMIC_BUCK: MPU_VIN

### Notes on the sheet
- Add multi-channel supervisor
- Battery options: LP804241
- NTC_R1 = 12,160R
- NTC_R2 = 3320R
- VCOLD = 5C or 68%
- VHOT = 55C or 36%
- ~92% efficient
- 2.5A MAX
- 2A MAX
- ~80% efficient
- STPMIC25A
- ~88% efficient
- 1A MAX
- Notes
- BUCK1 & BUCK6: 500, 1000, 1500, 2500mA
- Current Limits
- 5A MAX
- BUCK2 & BUCK3: 500, 1000, 1500, 2500mA
- BUCK4 & BUCK5: 250, 500mA
- LDO1: 20mA
- LDO2,5,6,7: 75, 150, 300, 600mA
- BUCK7: 500, 1000, 1500, 2500mA
- LDO8: 150mA
- LDO4: 40mA
- LDO3: 120mA
- Changes in Device Tree:
- Adjust buck6 to be 1.1V to be LPDDR4 compatible
- Adjust LDO2 to be 1.8V
- BUCK7 to 3V3
- BUCK4 to 1V8
- LDO5 to 3V3
- Text
- Turn on Order
- VIN (in this case 3V3)
- @ 2.3V VinPOR threshold has been reached
- Negative rail - op amp power biasing
- positive rail -> HPVDD_L rail
- 6ms passes until VDDIO turns on to its VDD level on Buck4
- VDDA1V8 then turns on @ LDO1
- PWR_CPU_ON control pin is asserted
- PMU inits until PINOK or 4V has been reached
- Change power rauls so reset lines are used by LDO
- Figure out what should be used in terms of the LDOs
- After 1.5ms, VDDCORE on Buck 2 turns on
- After another 1.5ms, VDDCPU turns on on Buck1
- PWR_ON is then asserted high
- (near C199) Sort out power domains for specific devices (ie eMMC, etc)
- Change casecode 0201 caps to 0402
- BUCK5 then turns on it's 1V8 output after 1.5ms
- BUCK7 then turns on after another 1.5ms at 3V3
- Almost immediately after VDD_EMMC is then turned on on LDO2
- (near U6) Configure voltage
- Power up sequence done
- After 1.5ms, VDD3V3USB is turned on at LDO4
- NRST or device reset is unasserted high
- If control bit is asserted, VDDGPU power domain is bought high on BUCK3
- Firmware controlled power sequencing
- NRSTCMS is bought high also
- Presume ~96% Efficiency
- Hardfault causes
- Thermal shutdown
- If VINOK > VIN
- Bypass mode!
- Internal watchdog is triggered
- PONKEY_n is pressed for a long time
- (near U6) 110kR pull up internal typ
- (near U6) 4MR pull up internal typ
- (near U6) 80kR pull up internal typ
- DWG NO:
- REV:
- THIS DOCUMENT AND THE DATA DISCLOSED HEREIN OR
- HEREWITH IS THE PROPERTY OF ALTIUM LIMITED AND MAY
- BE FREELY DISTRIBUTED IN WHOLE. NO RIGHTS ARE
- RESERVED OR EXPRESS OR IMPLIED WARANTEE GIVEN.
- REVISION
- DESCRIPTION
- DATE
- APPROVED
- ENG:
- APPROVALS
- PROJECT
- DSN:
- CHK:
- REFERENCE DOCUMENTS
- PROJECT REVISION:
- TITLE
- DOCUMENT REVISION:
- DESIGN ITEM:
- BOM:
- FAB DWG:
- PCB DWG:
- ASSY DWG:
- SCALE:
- A2
- SIZE
- CAGE CODE
- FILE NAME
- DWG NO.
- SHEET
- OF
- REV
- (in symbol CL05A475MO5NUNC) 4.7uF 20V @ 20% 0402
- (in symbol ERJ-1GNF33R0C) 33R 0.05W 1% 0201
- (in symbol ERJ-1GNF1002C) 10kR 0.05W 1% 0201
- (in symbol ERJ-1GNF3321C) 3.32kR 0.05W 1% 0201
- (in symbol GRM033R61A225KE47D) 2.2uF 10V @ 10% 0201
- (in symbol GRM033R61C105ME15D) 1uF 16V @ 20% 0201
- (in symbol GRM033R61E104KE14J) 0.1uF 16V @ 10% 0201
- (in symbol GRM155R61A106ME11D) 10uF 10V @ 20% 0402
- (in symbol GRM158R61A226ME15D) 22uF 10V @ 20% 0402
- (in symbol GRT033R61C473KE01J) 0.047uF 16V @ 10% 0201
- (in symbol GRT155R61A106ME13J) 10uF 10V @ 20% 0402
- (in symbol IHHP0805ZHER1R0M01) 1uH 3.2A 55mR 0805
- (in symbol RC0201FR-072K2L) 2.2kR 0.05W 1% 0201
- (in symbol RC0201FR-07200KL) 200kR 0.05W 1% 0201
- (in symbol RK73H1HTTC1212F) 12.1kR 0.05W 1% 0201
- (in symbol STPMIC25, part A) GENERAL PURPOSE; VDDQDDR; VDDA18; VDD_VIO; VDDGPU; VDDCORE; VDDCPU
- (in symbol STPMIC25, part B) VDDIO_SDMMC(3V3); VDD_SDMMC(3V3); GENERAL USE; VPP_DDR(2V5); VDD3V3_USB; VTT_DDR (0V6); VDD_EMMC (3V3); VDDA1V8_AON

### Library data of the parts
C152 C159 C161 C163 C165 C167 C169 C171 C173 C175 C177 C179 C183 C186 C189 C192 C195 C198 C200 C202 C204 C206 C208 C271 C277 = GRM033R61E104KE14J: as C98-C125 on sheet LPDDR4; ComponentLink1Description: New link; ComponentLink1URL: https://www.digikey.com.au/en/products/detail/murata-electronics/GRM033R61E104KE14J/4904732?s=N4IgTCBcDaIOICUCyAGAzGhA2AjAURxQBYBpAogKRAF0BfIA
C153 C172 C207 C211 C272 C276 = CL05A475MO5NUNC: as C97 on sheet LPDDR4
C154 = GRM033R61A225KE47D: 2.2 µF ±10% 10V Ceramic Capacitor X5R 0201 (0603 Metric); ComponentLink1Description: New link; ComponentLink1URL: https://www.digikey.com.au/en/products/detail/murata-electronics/GRM033R61A225KE47D/5877390
C160 C162 C164 C166 C168 C170 C199 C201 C203 C205 = GRT155R61A106ME13J: 10 µF ±20% 10V Ceramic Capacitor X5R 0402 (1005 Metric); ComponentLink1Description: New link; ComponentLink1URL: https://www.digikey.com.au/en/products/detail/murata-electronics/GRT155R61A106ME13J/19115510
C174 C176 C178 C180 = GRM033R61C105ME15D: 1 µF ±20% 16V Ceramic Capacitor X5R 0201 (0603 Metric); ComponentLink1Description: New link; ComponentLink1URL: https://www.digikey.com.au/en/products/detail/murata-electronics/GRM033R61C105ME15D/10326307
C181 C182 C184 C185 C187 C188 C190 C191 C193 C194 C196 C197 = GRM158R61A226ME15D: 22uH 0402; ComponentLink1Description: New link; ComponentLink1URL: https://www.digikey.com.au/en/products/detail/murata-electronics/GRM158R61A226ME15D/16033379
C273 = GRT033R61C473KE01J: 0.047 µF ±10% 16V Ceramic Capacitor X5R 0201 (0603 Metric); Supplier 1: DigiKey; Supplier Part Number 1: 490-GRT033R61C473KE01JCT-ND
C274 C275 = GRM155R61A106ME11D: 10 µF ±20% 10V Ceramic Capacitor X5R 0402 (1005 Metric); Supplier 1: Arrow Electronics; Supplier Part Number 1: GRM155R61A106ME11D
D1 = BZX884B15L-G3-08: Zener Diode 15 V 300 mW ±2% Surface Mount DFN1006-2A; ComponentLink1Description: New link; ComponentLink1URL: https://www.digikey.com.au/en/products/detail/vishay-general-semiconductor-diodes-division/BZX884B15L-G3-08/14312748
D30 = RCLAMP04041PW.C: 8V Clamp 20A (8/20µs) Ipp Tvs Diode Surface Mount 2-DFN (1x0.6); ComponentLink1Description: New link; ComponentLink1URL: https://www.digikey.com.au/en/products/detail/semtech-corporation/RCLAMP04041PW-C/21379403
F1-F3 = 0603L150SLYR: Polymeric PTC Resettable Fuse 6V 1.5 A Ih Surface Mount 0603 (1608 Metric), Concave; MF: Littelfuse Inc.; SnapEDA_Link: https://www.snapeda.com/parts/0603L150SLYR/Littelfuse/view-part/?ref=snap; Package: 0603-2 LITTELFUSE; Value: *; MP: 0603L150SLYR; Check_prices: https://www.snapeda.com/parts/0603L150SLYR/Littelfuse/view-part/?ref=eda; ComponentLink1Description: New link; ComponentLink1URL: https://www.digikey.com.au/en/products/detail/littelfuse-inc/0603L150SLYR/3429591
K1 = pad input for battery: PAD on PCB representing power input for embedded LiPo battery.
L1 L2 L5 L6 = DFE201610E-R68M=P2: DFE201610E-R68M=P; Manufacturer_Name: Murata Electronics; Datasheet Link: https://search.murata.co.jp/Ceramy/image/img/P02/J(E)TE243A-0001.pdf; Height: 1mm; Manufacturer_Part_Number: DFE201610E-R68M=P2; Mouser Part Number: 81-DFE201610E-R68MP2; Mouser Price/Stock: https://www.mouser.co.uk/ProductDetail/Murata-Electronics/DFE201610E-R68M%3dP2?qs=AQlKX63v8RudjlTUxbAxDg%3D%3D; Arrow Part Number: DFE201610E-R68M=P2; Arrow Price/Stock: https://www.arrow.com/en/products/dfe201610e-r68mp2/murata-manufacturing?region=nac
L3 L4 = DFE201610E-2R2M=P2: Inductor; Manufacturer_Name: Murata Electronics; Datasheet Link: https://search.murata.co.jp/Ceramy/image/img/P02/J(E)TE243A-0001.pdf; Height: 1mm; Manufacturer_Part_Number: DFE201610E-2R2M=P2; Mouser Part Number: 81-DFE201610E-2R2MP2; Mouser Price/Stock: https://www.mouser.co.uk/ProductDetail/Murata-Electronics/DFE201610E-2R2M%3dP2?qs=AQlKX63v8Rv49b3hcvXgWQ%3D%3D; Arrow Part Number: DFE201610E-2R2M=P2; Arrow Price/Stock: https://www.arrow.com/en/products/dfe201610e-2r2mp2/murata-manufacturing?utm_currency=USD&region=nac
L11 = IHHP0805ZHER1R0M01: 1 µH Shielded Inductor 3.2 A 55mOhm Max 0805 (2012 Metric); Supplier 1: DigiKey; Supplier Part Number 1: 541-IHHP0805ZHER1R0M01CT-ND
NTC1 = B57540G1103F000: NTC Thermistor 10k Bead, Glass; Supplier 1: DigiKey; Supplier Part Number 1: 495-5054-ND
R13 R14 R26 R27 = RC0201FR-072K2L: 2.2 kOhms ±1% 0.05W, 1/20W Chip Resistor 0201 (0603 Metric) Moisture Resistant Thick Film
R15 R21 R22 R28 R29 R38-R40 = ERJ-1GNF1002C: 10 kOhms ±1% 0.05W, 1/20W Chip Resistor 0201 (0603 Metric) Thick Film; ComponentLink1Description: New link; ComponentLink1URL: https://www.digikey.com.au/en/products/detail/panasonic-electronic-components/ERJ-1GNF1002C/2036226
R16-R20 R30-R37 = ERJ-1GNF33R0C: 33 Ohms ±1% 0.05W, 1/20W Chip Resistor 0201 (0603 Metric) Thick Film; ComponentLink1Description: New link; ComponentLink1URL: https://www.digikey.com.au/en/products/detail/panasonic-electronic-components/ERJ-1GNF33R0C/2035941
R173 = RC0201FR-07200KL: 200 kOhms ±1% 0.05W, 1/20W Chip Resistor 0201 (0603 Metric) Moisture Resistant Thick Film; Supplier 1: DigiKey; Supplier Part Number 1: YAG2275CT-ND
R174 = RK73H1HTTC1212F: 12.1 kOhms ±1% 0.05W, 1/20W Chip Resistor 0201 (0603 Metric) Automotive AEC-Q200 Thick Film; Supplier 1: DigiKey; Supplier Part Number 1: 2019-RK73H1HTTC1212FCT-ND
R175 = ERJ-1GNF3321C: 3.32 kOhms ±1% 0.05W, 1/20W Chip Resistor 0201 (0603 Metric) Thick Film; Supplier 1: Arrow Electronics; Supplier Part Number 1: ERJ-1GNF3321C
U3#1 = BQ27427YZFR: Single-cell battery fuel gauge with pre-programmed chemistry and integrated sense resistor; MF: Texas Instruments; SnapEDA_Link: https://www.snapeda.com/parts/BQ27427YZFR/Texas+Instruments/view-part/?ref=snap; Package: None; Value: *; MP: BQ27427YZFR; Check_prices: https://www.snapeda.com/parts/BQ27427YZFR/Texas+Instruments/view-part/?ref=eda
U20 = MP2723GQC-0000-P: 3A, I2C-Controlled SW Charger with NVDC Power Path and USB OTG

## Sheet CPU_Peripherals.SchDoc
size 594 x 420 mm; SheetNumber: 11; SheetTotal: 16
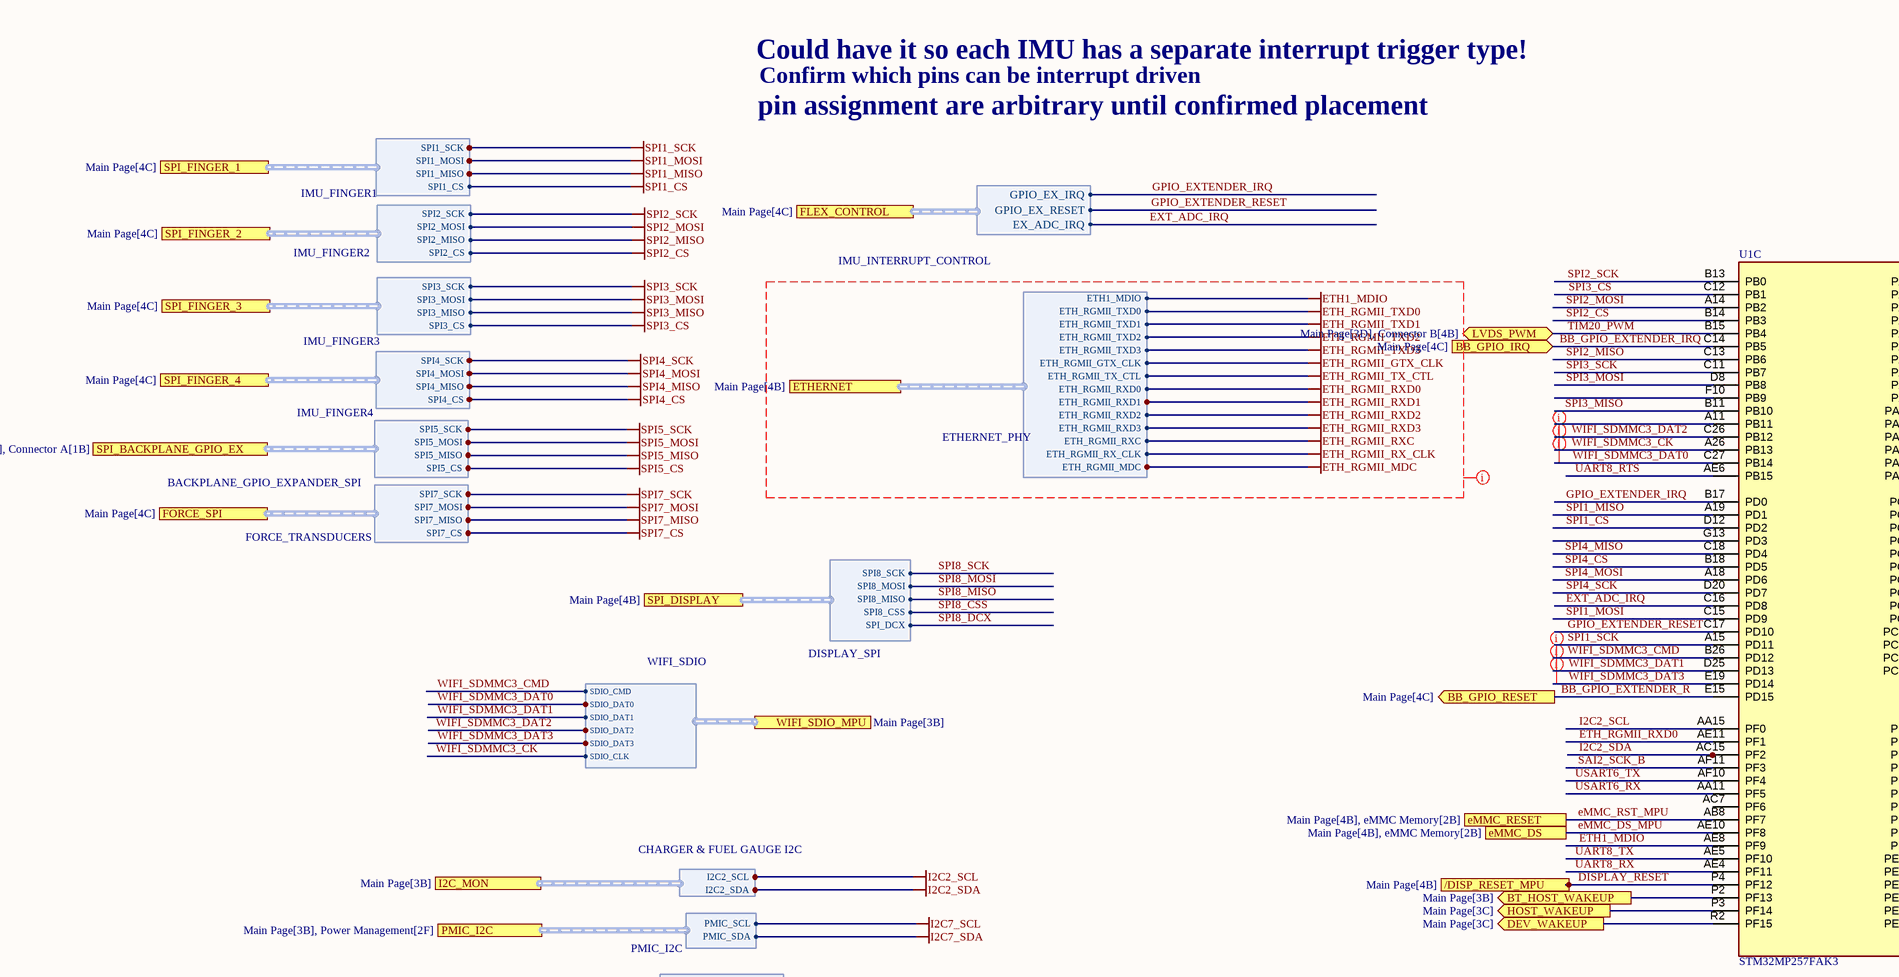
[diagram p10: CPU_Peripherals.SchDoc, top left]
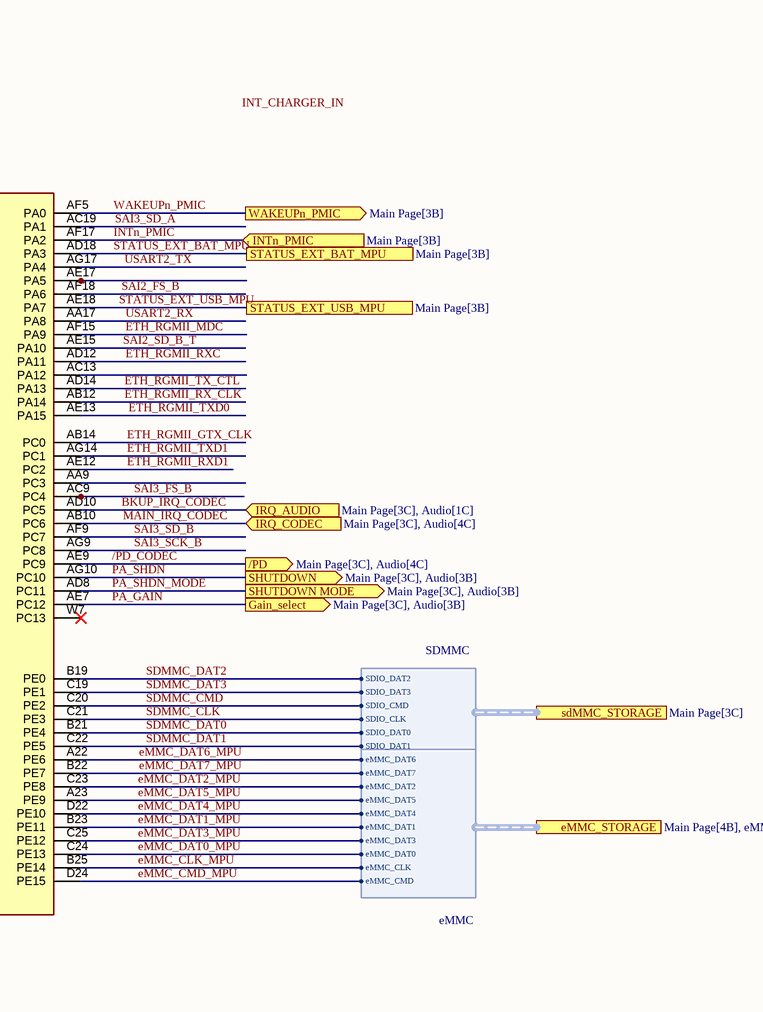
[diagram p11: CPU_Peripherals.SchDoc, top right]
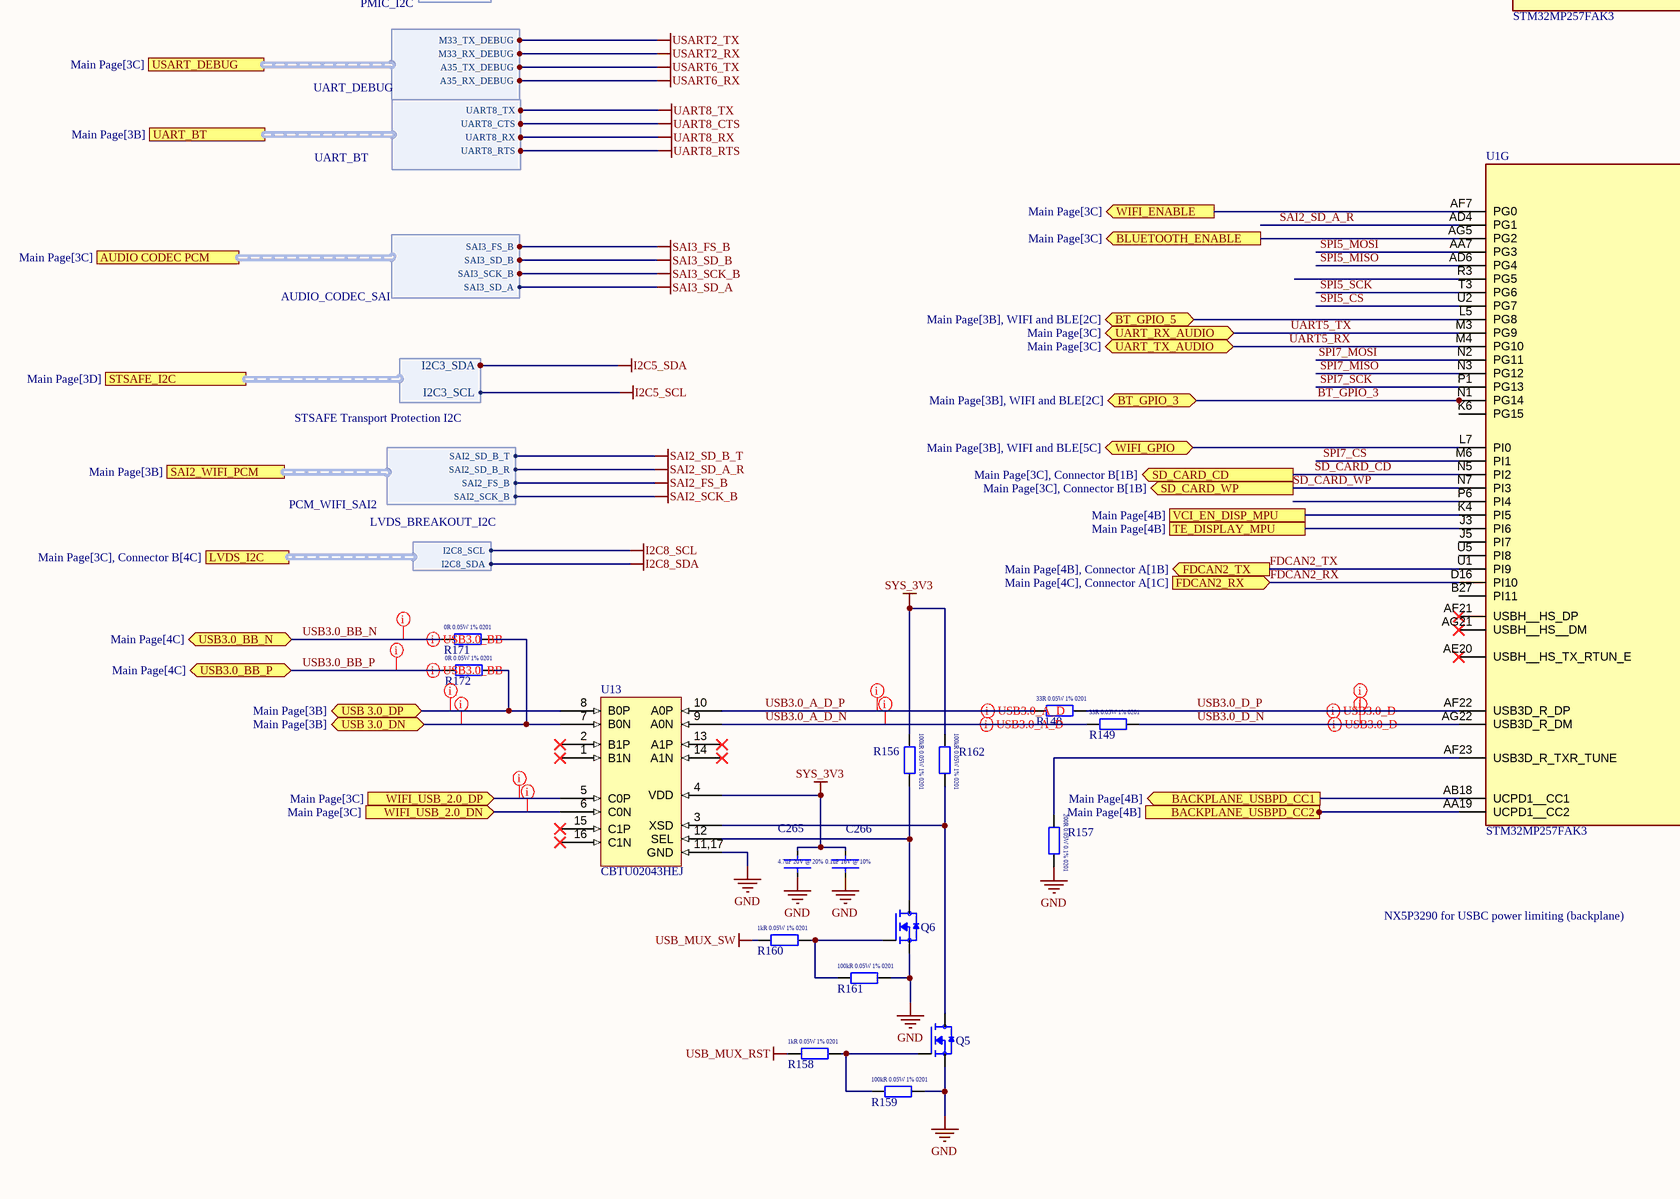
[diagram p12: CPU_Peripherals.SchDoc, bottom left]
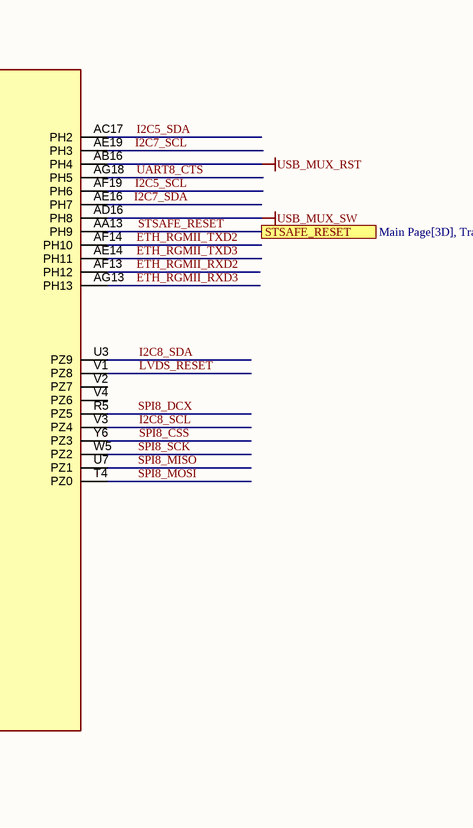
[diagram p13: CPU_Peripherals.SchDoc, bottom right]

### Parts
C265  4.7uF  [CAPC1005X06L]  (value not drawn)
C266  0.1uF  [CAPC0603X03L]  (value not drawn)
Q5  SSM3K15ACT,L3F  [SSM3K15ACT]  (value not drawn)
Q6  SSM3K15ACT,L3F  [SSM3K15ACT]  (value not drawn)
R148  ERJ-1GNF33R0C  [RESC0603X03L]  (value not drawn)
R149  ERJ-1GNF33R0C  [RESC0603X03L]  (value not drawn)
R156  ERJ-1GNF1003C  [RESC0603X03L]  (value not drawn)
R157  ERA-1AEB201C  [RESC0603X03L]  (value not drawn)
R158  ERJ-1GNF1001C  [RESC0603X03L]  (value not drawn)
R159  ERJ-1GNF1003C  [RESC0603X03L]  (value not drawn)
R160  ERJ-1GNF1001C  [RESC0603X03L]  (value not drawn)
R161  ERJ-1GNF1003C  [RESC0603X03L]  (value not drawn)
R162  ERJ-1GNF1003C  [RESC0603X03L]  (value not drawn)
R171  ERJ-1GN0R00C  [RESC0603X03L]  (value not drawn)
R172  ERJ-1GN0R00C  [RESC0603X03L]  (value not drawn)
U1  STM32MP257FAK3  [STM32MP257FAK3]  (parts C,G of 7)
U13  CBTU02043HEJ  [CBTU02043HEJ]

### Ports
/DISP_RESET_MPU (out, see Main Page[4B]), /PD (out, see Main Page[3C], Audio[4C]), AUDIO CODEC PCM (harness AUDIO_CODEC_SAI, see Main Page[3C]), BACKPLANE_USBPD_CC1 (out, see Main Page[4B]), BACKPLANE_USBPD_CC2 (out, see Main Page[4B]), BB_GPIO_IRQ (in, see Main Page[4C]), BB_GPIO_RESET (out, see Main Page[4C]), BLUETOOTH_ENABLE (out, see Main Page[3C]), BT_GPIO_3 (bidir, see Main Page[3B], WIFI and BLE[2C]), BT_GPIO_5 (bidir, see Main Page[3B], WIFI and BLE[2C]), BT_HOST_WAKEUP (out, see Main Page[3B]), DEV_WAKEUP (out, see Main Page[3C]), eMMC_DS (see Main Page[4B], eMMC Memory[2B]), eMMC_RESET (see Main Page[4B], eMMC Memory[2B]), eMMC_STORAGE (harness eMMC, see Main Page[4B], eMMC Memory[1B]), ETHERNET (harness ETHERNET_PHY, see Main Page[4B]), FDCAN2_RX (in, see Main Page[4C], Connector A[1C]), FDCAN2_TX (out, see Main Page[4B], Connector A[1B]), FLEX_CONTROL (harness IMU_INTERRUPT_CONTROL, see Main Page[4C]), FORCE_SPI (harness FORCE_TRANSDUCERS, see Main Page[4C]), Gain_select (out, see Main Page[3C], Audio[3B]), HOST_WAKEUP (out, see Main Page[3C]), I2C_MON (harness CHARGER & FUEL GAUGE I2C, see Main Page[3B]), INTn_PMIC (in, see Main Page[3B]), IRQ_AUDIO (in, see Main Page[3C], Audio[1C]), IRQ_CODEC (in, see Main Page[3C], Audio[4C]), LVDS_I2C (harness LVDS_BREAKOUT_I2C, see Main Page[3C], Connector B[4C]), LVDS_PWM (bidir, see Main Page[3D], Connector B[4B]), PMIC_I2C (harness PMIC_I2C, see Main Page[3B], Power Management[2F]), SAI2_WIFI_PCM (harness PCM_WIFI_SAI2, see Main Page[3B]), SD_CARD_CD (out, see Main Page[3C], Connector B[1B]), SD_CARD_WP (out, see Main Page[3C], Connector B[1B]), sdMMC_STORAGE (harness SDMMC, see Main Page[3C]), SHUTDOWN (out, see Main Page[3C], Audio[3B]), SHUTDOWN MODE (out, see Main Page[3C], Audio[3B]), SPI_BACKPLANE_GPIO_EX (harness BACKPLANE_GPIO_EXPANDER_SPI, see Main Page[4B], Connector A[1B]), SPI_DISPLAY (harness DISPLAY_SPI, see Main Page[4B]), SPI_FINGER_1 (harness IMU_FINGER1, see Main Page[4C]), SPI_FINGER_2 (harness IMU_FINGER2, see Main Page[4C]), SPI_FINGER_3 (harness IMU_FINGER3, see Main Page[4C]), SPI_FINGER_4 (harness IMU_FINGER4, see Main Page[4C]), STATUS_EXT_BAT_MPU (see Main Page[3B]), STATUS_EXT_USB_MPU (see Main Page[3B]), STSAFE_I2C (harness STSAFE Transport Protection I2C, see Main Page[3D]), STSAFE_RESET (see Main Page[3D], Transport Layer Security[3B]), TE_DISPLAY_MPU (see Main Page[4B]), UART_BT (harness UART_BT, see Main Page[3B]), UART_RX_AUDIO (bidir, see Main Page[3C]), UART_TX_AUDIO (bidir, see Main Page[3C]), USART_DEBUG (harness UART_DEBUG, see Main Page[3C]), USB3.0_BB_N (bidir, see Main Page[4C]), USB3.0_BB_P (bidir, see Main Page[4C]), USB 3.0_DN (bidir, see Main Page[3B]), USB 3.0_DP (bidir, see Main Page[3B]), VCI_EN_DISP_MPU (see Main Page[4B]), WAKEUPn_PMIC (out, see Main Page[3B]), WIFI_ENABLE (out, see Main Page[3C]), WIFI_GPIO (bidir, see Main Page[3B], WIFI and BLE[5C]), WIFI_SDIO_MPU (harness WIFI_SDIO, see Main Page[3B]), WIFI_USB_2.0_DN (in, see Main Page[3C]), WIFI_USB_2.0_DP (in, see Main Page[3C])

### Harnesses
eMMC: eMMC_CLK, eMMC_CMD, eMMC_DAT0, eMMC_DAT1, eMMC_DAT2, eMMC_DAT3, eMMC_DAT4, eMMC_DAT5, eMMC_DAT6, eMMC_DAT7
SDMMC: SDIO_DAT2, SDIO_DAT3, SDIO_DAT0, SDIO_DAT1, SDIO_CMD, SDIO_CLK
WIFI_SDIO: SDIO_DAT2, SDIO_DAT3, SDIO_DAT0, SDIO_DAT1, SDIO_CMD, SDIO_CLK
UART_DEBUG: M33_TX_DEBUG, M33_RX_DEBUG, A35_TX_DEBUG, A35_RX_DEBUG
UART_BT: UART8_TX, UART8_CTS, UART8_RX, UART8_RTS
ETHERNET_PHY: ETH_RGMII_GTX_CLK, ETH_RGMII_TX_CTL, ETH_RGMII_RXD0, ETH_RGMII_RXD1, ETH_RGMII_TXD0, ETH_RGMII_TXD1, ETH_RGMII_TXD2, ETH_RGMII_TXD3, ETH_RGMII_RXD2, ETH_RGMII_RXD3, ETH_RGMII_RXC, ETH_RGMII_RX_CLK, ETH_RGMII_MDC, ETH1_MDIO
AUDIO_CODEC_SAI: SAI3_FS_B, SAI3_SD_B, SAI3_SCK_B, SAI3_SD_A
IMU_FINGER1: SPI1_SCK, SPI1_MOSI, SPI1_MISO, SPI1_CS
IMU_FINGER2: SPI2_SCK, SPI2_MOSI, SPI2_MISO, SPI2_CS
IMU_FINGER3: SPI3_SCK, SPI3_MOSI, SPI3_MISO, SPI3_CS
IMU_FINGER4: SPI4_SCK, SPI4_MOSI, SPI4_MISO, SPI4_CS
BACKPLANE_GPIO_EXPANDER_SPI: SPI5_SCK, SPI5_MOSI, SPI5_MISO, SPI5_CS
FORCE_TRANSDUCERS: SPI7_SCK, SPI7_MOSI, SPI7_MISO, SPI7_CS
CHARGER & FUEL GAUGE I2C: I2C2_SCL, I2C2_SDA
PCM_WIFI_SAI2: SAI2_SD_B_R, SAI2_FS_B, SAI2_SCK_B, SAI2_SD_B_T
DISPLAY_SPI: SPI8_SCK, SPI8_MOSI, SPI8_MISO, SPI_DCX, SPI8_CSS
PMIC_I2C: PMIC_SCL, PMIC_SDA
STSAFE Transport Protection I2C: I2C3_SCL, I2C3_SDA
LVDS_BREAKOUT_I2C: I2C8_SCL, I2C8_SDA
IMU_INTERRUPT_CONTROL: GPIO_EX_IRQ, GPIO_EX_RESET, EX_ADC_IRQ

### Nets
ETH1_MDIO: U1.AE8(PF9) ; port ETHERNET.ETH1_MDIO
ETH_RGMII_GTX_CLK: U1.AB14(PC0) ; port ETHERNET.ETH_RGMII_GTX_CLK
ETH_RGMII_MDC: U1.AF15(PA9) ; port ETHERNET.ETH_RGMII_MDC
ETH_RGMII_RX_CLK: U1.AB12(PA14) ; port ETHERNET.ETH_RGMII_RX_CLK
ETH_RGMII_RXC: U1.AD12(PA11) ; port ETHERNET.ETH_RGMII_RXC
ETH_RGMII_RXD0: U1.AE11(PF1) ; port ETHERNET.ETH_RGMII_RXD0
ETH_RGMII_RXD1: U1.AE12(PC2) ; port ETHERNET.ETH_RGMII_RXD1
ETH_RGMII_RXD2: U1.AF13(PH12) ; port ETHERNET.ETH_RGMII_RXD2
ETH_RGMII_RXD3: U1.AG13(PH13) ; port ETHERNET.ETH_RGMII_RXD3
ETH_RGMII_TX_CTL: U1.AD14(PA13) ; port ETHERNET.ETH_RGMII_TX_CTL
ETH_RGMII_TXD0: U1.AE13(PA15) ; port ETHERNET.ETH_RGMII_TXD0
ETH_RGMII_TXD1: U1.AG14(PC1) ; port ETHERNET.ETH_RGMII_TXD1
ETH_RGMII_TXD2: U1.AF14(PH10) ; port ETHERNET.ETH_RGMII_TXD2
ETH_RGMII_TXD3: U1.AE14(PH11) ; port ETHERNET.ETH_RGMII_TXD3
GND: C265.1 C266.1 Q5.3(S) Q6.3(S) R157.2 R159.2 R161.2 U13.11,17(GND)
I2C2_SCL: U1.AA15(PF0) ; port I2C_MON.I2C2_SCL
I2C2_SDA: U1.AC15(PF2) ; port I2C_MON.I2C2_SDA
I2C5_SCL: U1.AF19(PH6) ; port STSAFE_I2C.I2C3_SCL
I2C5_SDA: U1.AC17(PH2) ; port STSAFE_I2C.I2C3_SDA
I2C7_SCL: U1.AE19(PH3) ; port PMIC_I2C.PMIC_SCL
I2C7_SDA: U1.AE16(PH7) ; port PMIC_I2C.PMIC_SDA
I2C8_SCL: U1.V3(PZ4) ; port LVDS_I2C.I2C8_SCL
I2C8_SDA: U1.U3(PZ9) ; port LVDS_I2C.I2C8_SDA
SAI2_FS_B: U1.AF18(PA6) ; port SAI2_WIFI_PCM.SAI2_FS_B
SAI2_SCK_B: U1.AF11(PF3) ; port SAI2_WIFI_PCM.SAI2_SCK_B
SAI2_SD_A_R: U1.AD4(PG1) ; port SAI2_WIFI_PCM.SAI2_SD_B_R
SAI2_SD_B_T: U1.AE15(PA10) ; port SAI2_WIFI_PCM.SAI2_SD_B_T
SAI3_FS_B: U1.AC9(PC4) ; port AUDIO CODEC PCM.SAI3_FS_B
SAI3_SCK_B: U1.AG9(PC8) ; port AUDIO CODEC PCM.SAI3_SCK_B
SAI3_SD_A: U1.AC19(PA1) ; port AUDIO CODEC PCM.SAI3_SD_A
SAI3_SD_B: U1.AF9(PC7) ; port AUDIO CODEC PCM.SAI3_SD_B
SPI1_CS: U1.D12(PD2) ; port SPI_FINGER_1.SPI1_CS
SPI1_MISO: U1.A19(PD1) ; port SPI_FINGER_1.SPI1_MISO
SPI1_MOSI: U1.C15(PD9) ; port SPI_FINGER_1.SPI1_MOSI
SPI1_SCK: U1.A15(PD11) ; port SPI_FINGER_1.SPI1_SCK
SPI2_CS: U1.B14(PB3) ; port SPI_FINGER_2.SPI2_CS
SPI2_MISO: U1.C13(PB6) ; port SPI_FINGER_2.SPI2_MISO
SPI2_MOSI: U1.A14(PB2) ; port SPI_FINGER_2.SPI2_MOSI
SPI2_SCK: U1.B13(PB0) ; port SPI_FINGER_2.SPI2_SCK
SPI3_CS: U1.C12(PB1) ; port SPI_FINGER_3.SPI3_CS
SPI3_MISO: U1.B11(PB10) ; port SPI_FINGER_3.SPI3_MISO
SPI3_MOSI: U1.D8(PB8) ; port SPI_FINGER_3.SPI3_MOSI
SPI3_SCK: U1.C11(PB7) ; port SPI_FINGER_3.SPI3_SCK
SPI4_CS: U1.B18(PD5) ; port SPI_FINGER_4.SPI4_CS
SPI4_MISO: U1.C18(PD4) ; port SPI_FINGER_4.SPI4_MISO
SPI4_MOSI: U1.A18(PD6) ; port SPI_FINGER_4.SPI4_MOSI
SPI4_SCK: U1.D20(PD7) ; port SPI_FINGER_4.SPI4_SCK
SPI5_CS: U1.U2(PG7) ; port SPI_BACKPLANE_GPIO_EX.SPI5_CS
SPI5_MISO: U1.AD6(PG4) ; port SPI_BACKPLANE_GPIO_EX.SPI5_MISO
SPI5_MOSI: U1.AA7(PG3) ; port SPI_BACKPLANE_GPIO_EX.SPI5_MOSI
SPI5_SCK: U1.T3(PG6) ; port SPI_BACKPLANE_GPIO_EX.SPI5_SCK
SPI7_CS: U1.M6(PI1) ; port FORCE_SPI.SPI7_CS
SPI7_MISO: U1.N3(PG12) ; port FORCE_SPI.SPI7_MISO
SPI7_MOSI: U1.N2(PG11) ; port FORCE_SPI.SPI7_MOSI
SPI7_SCK: U1.P1(PG13) ; port FORCE_SPI.SPI7_SCK
SYS_3V3: C265.2 C266.2 R156.1 R162.1 U13.4(VDD)
UART8_CTS: U1.AG18(PH5) ; port UART_BT.UART8_CTS
UART8_RTS: U1.AE6(PB15) ; port UART_BT.UART8_RTS
UART8_RX: U1.AE4(PF11) ; port UART_BT.UART8_RX
UART8_TX: U1.AE5(PF10) ; port UART_BT.UART8_TX
USART2_RX: U1.AA17(PA8) ; port USART_DEBUG.M33_RX_DEBUG
USART2_TX: U1.AG17(PA4) ; port USART_DEBUG.M33_TX_DEBUG
USART6_RX: U1.AA11(PF5) ; port USART_DEBUG.A35_RX_DEBUG
USART6_TX: U1.AF10(PF4) ; port USART_DEBUG.A35_TX_DEBUG
USB_MUX_RST: R158.1 U1.AB16(PH4)
USB_MUX_SW: R160.1 U1.AD16(PH8)
/PD_CODEC: U1.AE9(PC9) ; port /PD
BB_GPIO_EXTENDER_IRQ: U1.C14(PB5) ; port BB_GPIO_IRQ
BB_GPIO_EXTENDER_R: U1.E15(PD15) ; port BB_GPIO_RESET
BKUP_IRQ_CODEC: U1.AD10(PC5) ; port IRQ_AUDIO
BT_GPIO_3: U1.N1(PG14) ; port BT_GPIO_3
DISPLAY_RESET: U1.P4(PF12) ; port /DISP_RESET_MPU
eMMC_CLK_MPU: U1.B25(PE14) ; port eMMC_STORAGE.eMMC_CLK
eMMC_CMD_MPU: U1.D24(PE15) ; port eMMC_STORAGE.eMMC_CMD
eMMC_DAT0_MPU: U1.C24(PE13) ; port eMMC_STORAGE.eMMC_DAT0
eMMC_DAT1_MPU: U1.B23(PE11) ; port eMMC_STORAGE.eMMC_DAT1
eMMC_DAT2_MPU: U1.C23(PE8) ; port eMMC_STORAGE.eMMC_DAT2
eMMC_DAT3_MPU: U1.C25(PE12) ; port eMMC_STORAGE.eMMC_DAT3
eMMC_DAT4_MPU: U1.D22(PE10) ; port eMMC_STORAGE.eMMC_DAT4
eMMC_DAT5_MPU: U1.A23(PE9) ; port eMMC_STORAGE.eMMC_DAT5
eMMC_DAT6_MPU: U1.A22(PE6) ; port eMMC_STORAGE.eMMC_DAT6
eMMC_DAT7_MPU: U1.B22(PE7) ; port eMMC_STORAGE.eMMC_DAT7
eMMC_DS_MPU: U1.AE10(PF8) ; port eMMC_DS
eMMC_RST_MPU: U1.AB8(PF7) ; port eMMC_RESET
EXT_ADC_IRQ: U1.C16(PD8) ; port FLEX_CONTROL.EX_ADC_IRQ
FDCAN2_RX: U1.D16(PI10) ; port FDCAN2_RX
FDCAN2_TX: U1.U1(PI9) ; port FDCAN2_TX
GPIO_EXTENDER_IRQ: U1.B17(PD0) ; port FLEX_CONTROL.GPIO_EX_IRQ
GPIO_EXTENDER_RESET: U1.C17(PD10) ; port FLEX_CONTROL.GPIO_EX_RESET
INTn_PMIC: U1.AF17(PA2) ; port INTn_PMIC
LVDS_RESET: U1.V1(PZ8)
MAIN_IRQ_CODEC: U1.AB10(PC6) ; port IRQ_CODEC
PA_GAIN: U1.AE7(PC12) ; port Gain_select
PA_SHDN: U1.AG10(PC10) ; port SHUTDOWN
PA_SHDN_MODE: U1.AD8(PC11) ; port SHUTDOWN MODE
SD_CARD_CD: U1.N5(PI2) ; port SD_CARD_CD
SD_CARD_WP: U1.N7(PI3) ; port SD_CARD_WP
SDMMC_CLK: U1.C21(PE3) ; port sdMMC_STORAGE.SDIO_CLK
SDMMC_CMD: U1.C20(PE2) ; port sdMMC_STORAGE.SDIO_CMD
SDMMC_DAT0: U1.B21(PE4) ; port sdMMC_STORAGE.SDIO_DAT0
SDMMC_DAT1: U1.C22(PE5) ; port sdMMC_STORAGE.SDIO_DAT1
SDMMC_DAT2: U1.B19(PE0) ; port sdMMC_STORAGE.SDIO_DAT2
SDMMC_DAT3: U1.C19(PE1) ; port sdMMC_STORAGE.SDIO_DAT3
SPI8_CSS: U1.Y6(PZ3) ; port SPI_DISPLAY.SPI8_CSS
SPI8_DCX: U1.R5(PZ5) ; port SPI_DISPLAY.SPI_DCX
SPI8_MISO: U1.U7(PZ1) ; port SPI_DISPLAY.SPI8_MISO
SPI8_MOSI: U1.T4(PZ0) ; port SPI_DISPLAY.SPI8_MOSI
SPI8_SCK: U1.W5(PZ2) ; port SPI_DISPLAY.SPI8_SCK
STATUS_EXT_BAT_MPU: U1.AD18(PA3) ; port STATUS_EXT_BAT_MPU
STATUS_EXT_USB_MPU: U1.AE18(PA7) ; port STATUS_EXT_USB_MPU
STSAFE_RESET: U1.AA13(PH9) ; port STSAFE_RESET
TIM20_PWM: U1.B15(PB4) ; port LVDS_PWM
UART5_RX: U1.M4(PG10) ; port UART_TX_AUDIO
UART5_TX: U1.M3(PG9) ; port UART_RX_AUDIO
USB3.0_A_D_N: R149.1 U13.9(A0N)
USB3.0_A_D_P: R148.1 U13.10(A0P)
USB3.0_BB_N: R171.1 ; port USB3.0_BB_N
USB3.0_BB_P: R172.1 ; port USB3.0_BB_P
USB3.0_D_N: R149.2 U1.AG22(USB3D_R_DM)
USB3.0_D_P: R148.2 U1.AF22(USB3D_R_DP)
USB_N: R171.2 U13.7(B0N) ; port USB 3.0_DN
USB_P: R172.2 U13.8(B0P) ; port USB 3.0_DP
WAKEUPn_PMIC: U1.AF5(PA0) ; port WAKEUPn_PMIC
WIFI_SDMMC3_CK: U1.A26(PB13) ; port WIFI_SDIO_MPU.SDIO_CLK
WIFI_SDMMC3_CMD: U1.B26(PD12) ; port WIFI_SDIO_MPU.SDIO_CMD
WIFI_SDMMC3_DAT0: U1.C27(PB14) ; port WIFI_SDIO_MPU.SDIO_DAT0
WIFI_SDMMC3_DAT1: U1.D25(PD13) ; port WIFI_SDIO_MPU.SDIO_DAT1
WIFI_SDMMC3_DAT2: U1.C26(PB12) ; port WIFI_SDIO_MPU.SDIO_DAT2
WIFI_SDMMC3_DAT3: U1.E19(PD14) ; port WIFI_SDIO_MPU.SDIO_DAT3
WIFI_USB_N: U13.6(C0N) ; port WIFI_USB_2.0_DN
WIFI_USB_P: U13.5(C0P) ; port WIFI_USB_2.0_DP
NetK4_10: U1.AA19(UCPD1__CC2) ; port BACKPLANE_USBPD_CC2
NetK4_12: U1.AB18(UCPD1__CC1) ; port BACKPLANE_USBPD_CC1
NetK6_2: U1.K4(PI5) ; port VCI_EN_DISP_MPU
NetK6_5: U1.J3(PI6) ; port TE_DISPLAY_MPU
NetQ5_1: Q5.1(G) R158.2 R159.1
NetQ5_2: Q5.2(D) R162.2 U13.3(XSD)
NetQ6_1: Q6.1(G) R160.2 R161.1
NetQ6_2: Q6.2(D) R156.2 U13.12(SEL)
NetR66_2: U1.AF7(PG0) ; port WIFI_ENABLE
NetR67_2: U1.AG5(PG2) ; port BLUETOOTH_ENABLE
NetR83_1: U1.L5(PG8) ; port BT_GPIO_5
NetR90_1: U1.P3(PF14) ; port HOST_WAKEUP
NetR157_1: R157.1 U1.AF23(USB3D_R_TXR_TUNE)
NetU1_L7: U1.L7(PI0) ; port WIFI_GPIO
NetU1_P2: U1.P2(PF13) ; port BT_HOST_WAKEUP
NetU1_R2: U1.R2(PF15) ; port DEV_WAKEUP

Not connected (* = marked no-connect by the designer): U1 A11(PB11) AA9(PC3) AC7(PF6) AC13(PA12) AE17(PA5) AE20(USBH__HS_TX_RTUN_E)* AF21(USBH__HS_DP)* AG21(USBH__HS__DM)* B27(PI11) F10(PB9) G13(PD3) J5(PI7) K6(PG15) P6(PI4) R3(PG5) U5(PI8) V2(PZ7) V4(PZ6) W7(PC13)*; U13 1(B1N)* 2(B1P)* 13(A1P)* 14(A1N)* 15(C1P)* 16(C1N)*

### Layout directives
net class WiFi & BlueTooth: WIFI_SDMMC3_CK, WIFI_SDMMC3_CMD, WIFI_SDMMC3_DAT0, WIFI_SDMMC3_DAT1, WIFI_SDMMC3_DAT2, WIFI_SDMMC3_DAT3
differential pair: USB3.0_A_D_N, USB3.0_A_D_P, USB3.0_BB_N, USB3.0_BB_P, USB3.0_D_N, USB3.0_D_P
net class Ethernet: ETH1_MDIO, ETH_RGMII_GTX_CLK, ETH_RGMII_MDC, ETH_RGMII_RX_CLK, ETH_RGMII_RXC, ETH_RGMII_RXD0, ETH_RGMII_RXD1, ETH_RGMII_RXD2, ETH_RGMII_RXD3, ETH_RGMII_TX_CTL, ETH_RGMII_TXD0, ETH_RGMII_TXD1, ETH_RGMII_TXD2, ETH_RGMII_TXD3
net class High Speed Digital: USB3.0_A_D_N, USB3.0_A_D_P, USB3.0_BB_N, USB3.0_BB_P, USB3.0_D_N, USB3.0_D_P, USB_N, USB_P, WIFI_USB_N, WIFI_USB_P

### Notes on the sheet
- Could have it so each IMU has a separate interrupt trigger type!
- Confirm which pins can be interrupt driven
- pin assignment are arbitrary until confirmed placement
- NX5P3290 for USBC power limiting (backplane)
- Labels drawn without touching a wire or pin: INT_CHARGER_IN
- DWG NO:
- REV:
- THIS DOCUMENT AND THE DATA DISCLOSED HEREIN OR
- HEREWITH IS THE PROPERTY OF ALTIUM LIMITED AND MAY
- BE FREELY DISTRIBUTED IN WHOLE. NO RIGHTS ARE
- RESERVED OR EXPRESS OR IMPLIED WARANTEE GIVEN.
- REVISION
- DESCRIPTION
- DATE
- APPROVED
- ENG:
- APPROVALS
- PROJECT
- DSN:
- CHK:
- REFERENCE DOCUMENTS
- PROJECT REVISION:
- TITLE
- DOCUMENT REVISION:
- DESIGN ITEM:
- BOM:
- FAB DWG:
- PCB DWG:
- ASSY DWG:
- SCALE:
- A2
- SIZE
- CAGE CODE
- FILE NAME
- DWG NO.
- SHEET
- OF
- REV
- (in symbol CL05A475MO5NUNC) 4.7uF 20V @ 20%
- (in symbol ERA-1AEB201C) 200R 0.05W 0.1% 0201
- (in symbol ERJ-1GN0R00C) 0R 0.05W 1% 0201
- (in symbol ERJ-1GNF33R0C) 33R 0.05W 1% 0201
- (in symbol ERJ-1GNF1001C) 1kR 0.05W 1% 0201
- (in symbol ERJ-1GNF1003C) 100kR 0.05W 1% 0201
- (in symbol GRM033R61E104KE14J) 0.1uF 16V @ 10%

### Library data of the parts
C265 = CL05A475MO5NUNC: as C97 on sheet LPDDR4
C266 = GRM033R61E104KE14J: as C98-C125 on sheet LPDDR4
Q5 Q6 = SSM3K15ACT,L3F: N-Channel 30 V 100mA (Ta) 100mW (Ta) Surface Mount CST3; ComponentLink1Description: New link; ComponentLink1URL: https://www.digikey.com.au/en/products/detail/toshiba-semiconductor-and-storage/SSM3K15ACT-L3F/5298026
R148 R149 = ERJ-1GNF33R0C: as R16-R20 on sheet Power Management; ComponentLink1Description: New link; ComponentLink1URL: https://www.digikey.com.au/en/products/detail/panasonic-electronic-components/ERJ-1GNF33R0C/2035941; Supplier 1: Mouser; Supplier Part Number 1: 667-ERJ-1GNF33R0C
R156 R159 R161 R162 = ERJ-1GNF1003C: as R8 on sheet LPDDR4; ComponentLink1Description: New link; ComponentLink1URL: https://www.digikey.com.au/en/products/detail/panasonic-electronic-components/ERJ-1GNF1003C/2036340
R157 = ERA-1AEB201C: 200 Ohms ±0.1% 0.05W, 1/20W Chip Resistor 0201 (0603 Metric) Automotive AEC-Q200 Thin Film; ComponentLink1Description: New link; ComponentLink1URL: https://www.digikey.com.au/en/products/detail/panasonic-electronic-components/ERA-1AEB201C/5035575
R158 R160 = ERJ-1GNF1001C: 1 kOhms ±1% 0.05W, 1/20W Chip Resistor 0201 (0603 Metric) Thick Film
R171 R172 = ERJ-1GN0R00C: 0 Ohms Jumper Chip Resistor 0201 (0603 Metric) Thick Film; ComponentLink1Description: New link; ComponentLink1URL: https://www.digikey.com.au/en/products/detail/panasonic-electronic-components/ERJ-1GN0R00C/3982613; Supplier 1: Mouser; Supplier Part Number 1: 667-ERJ-1GN0R00C
U1 = STM32MP257FAK3: Integrated Circuit; Manufacturer_Name: STMicroelectronics; Datasheet Link: https://www.digikey.ph/en/products/detail/stmicroelectronics/STM32MP257FAK3/24883094; Height: 1mm; Manufacturer_Part_Number: STM32MP257FAK3; Mouser Part Number: 511-STM32MP257FAK3; Mouser Price/Stock: https://www.mouser.co.uk/ProductDetail/STMicroelectronics/STM32MP257FAK3?qs=i8QVZAFTkqQulHX8Hxkfng%3D%3D; Arrow Part Number: STM32MP257FAK3; Arrow Price/Stock: https://www.arrow.com/en/products/stm32mp257fak3/stmicroelectronics?utm_currency=USD&region=nac
U13 = CBTU02043HEJ: USB Switch IC 2 Channel 16-HUQFN (1.6x2.4); Supplier 1: Arrow Electronics; Supplier Part Number 1: CBTU02043HEJ